# Altium project CMRat_GEN2.8.PrjPcb (part 1 of 2)
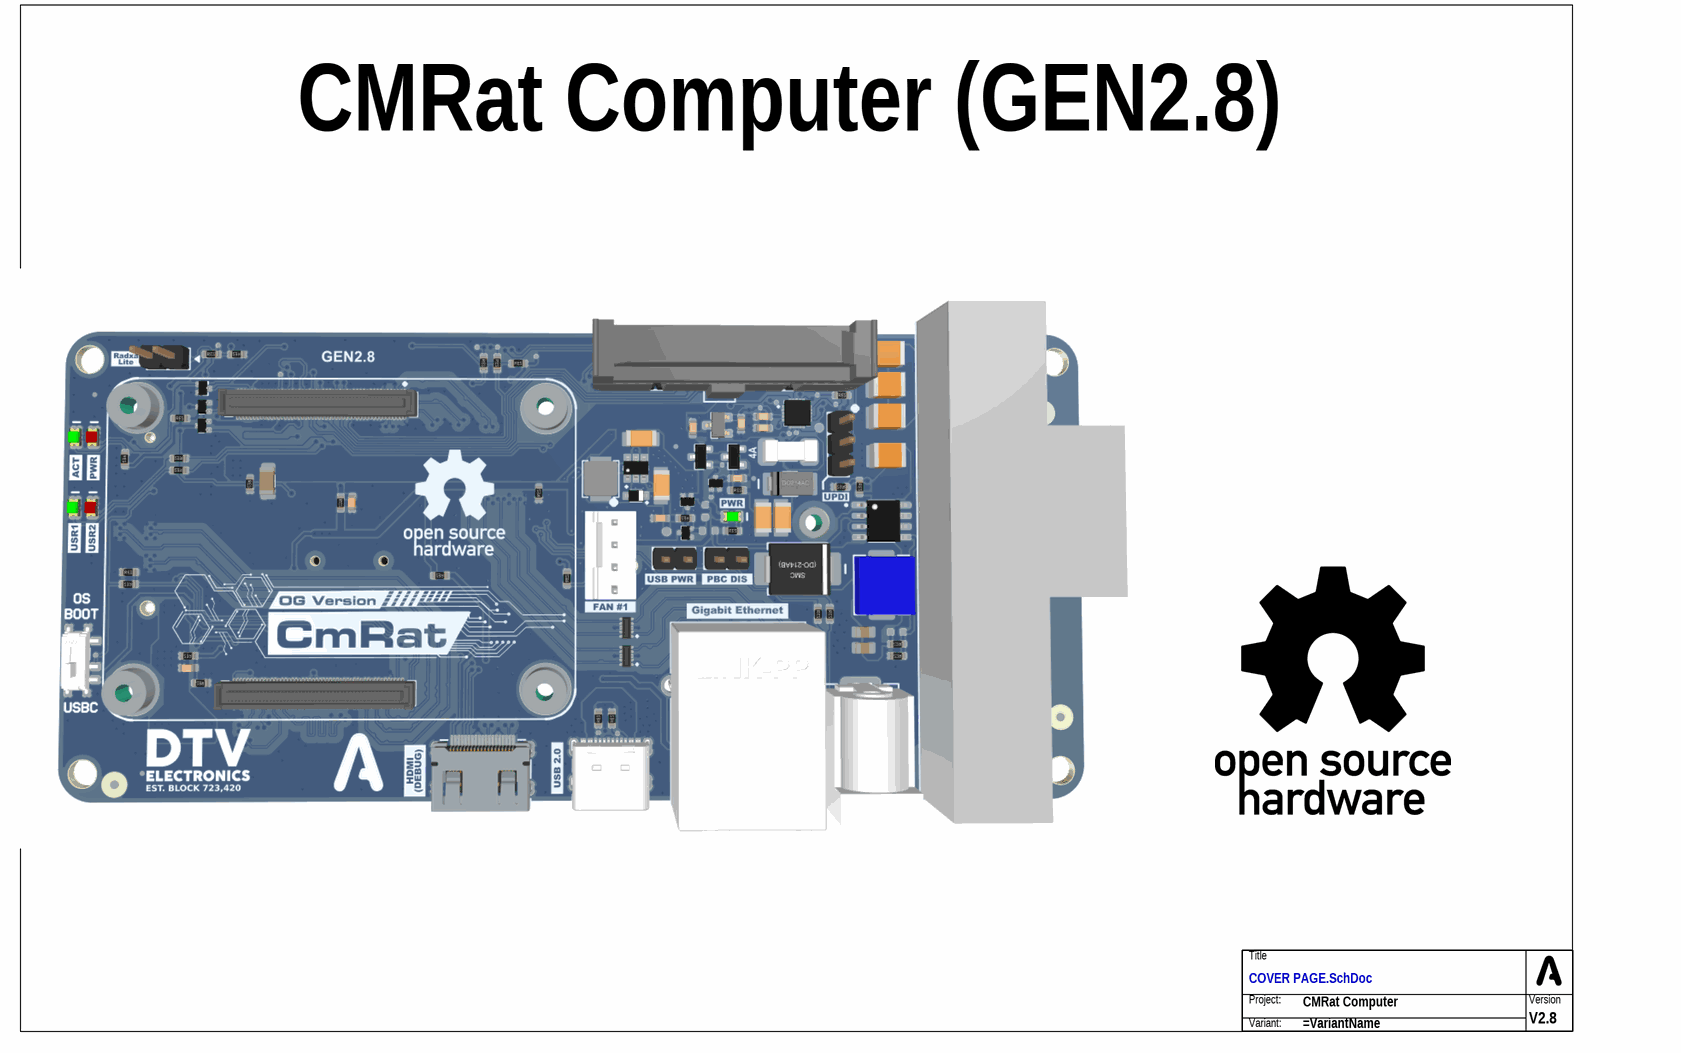
[diagram p0: COVER PAGE.SchDoc]
SchPcbVersion: V2.8; PCBProjectName: CMRat Computer (GEN2.8); PCBMarking: GEN2.8; OutputFileNamePrefix: CMRat_GEN2.8; OutputFileNamePrefix: CMRat_GEN2.8; GlobalProjectName: CMRat Computer
11 sheets, 217 parts. Net scope: global (net labels, ports and power ports of the same name join across sheets).
Board file: CMRat_GEN2.8.PcbDoc
Sheets:
  COVER PAGE.SchDoc
  TOP.SchDoc
    BLK1 = CM_MODULE.SchDoc
    BLK4 = PCIe.SchDoc
    BLK5 = USB_C.SchDoc
    BLK4 = Ethernet.SchDoc
    BLK4 = SD.SchDoc
    BLK4 = PWR.SchDoc
    BLK4 = MISC.SchDoc
    BLK4 = HDMI.SchDoc
    BLK4 = PBC.SchDoc

## Sheet COVER PAGE.SchDoc: =GlobalProjectName
size A4; SheetNumber: 1; SheetTotal: 11; Designators: -; PageSize: A3

### Parts
TB1  (no value)  (no BOM)

### Notes on the sheet
- (in symbol SCH_TITLE_BLOCK_SIMPLE_NODATE) Title; Project:; Version; Variant:

### Library data of the parts
TB1 = SCH_TITLE_BLOCK_SIMPLE_NODATE

## Sheet TOP.SchDoc: Top schematic
size A4; SheetNumber: 3; SheetTotal: 11
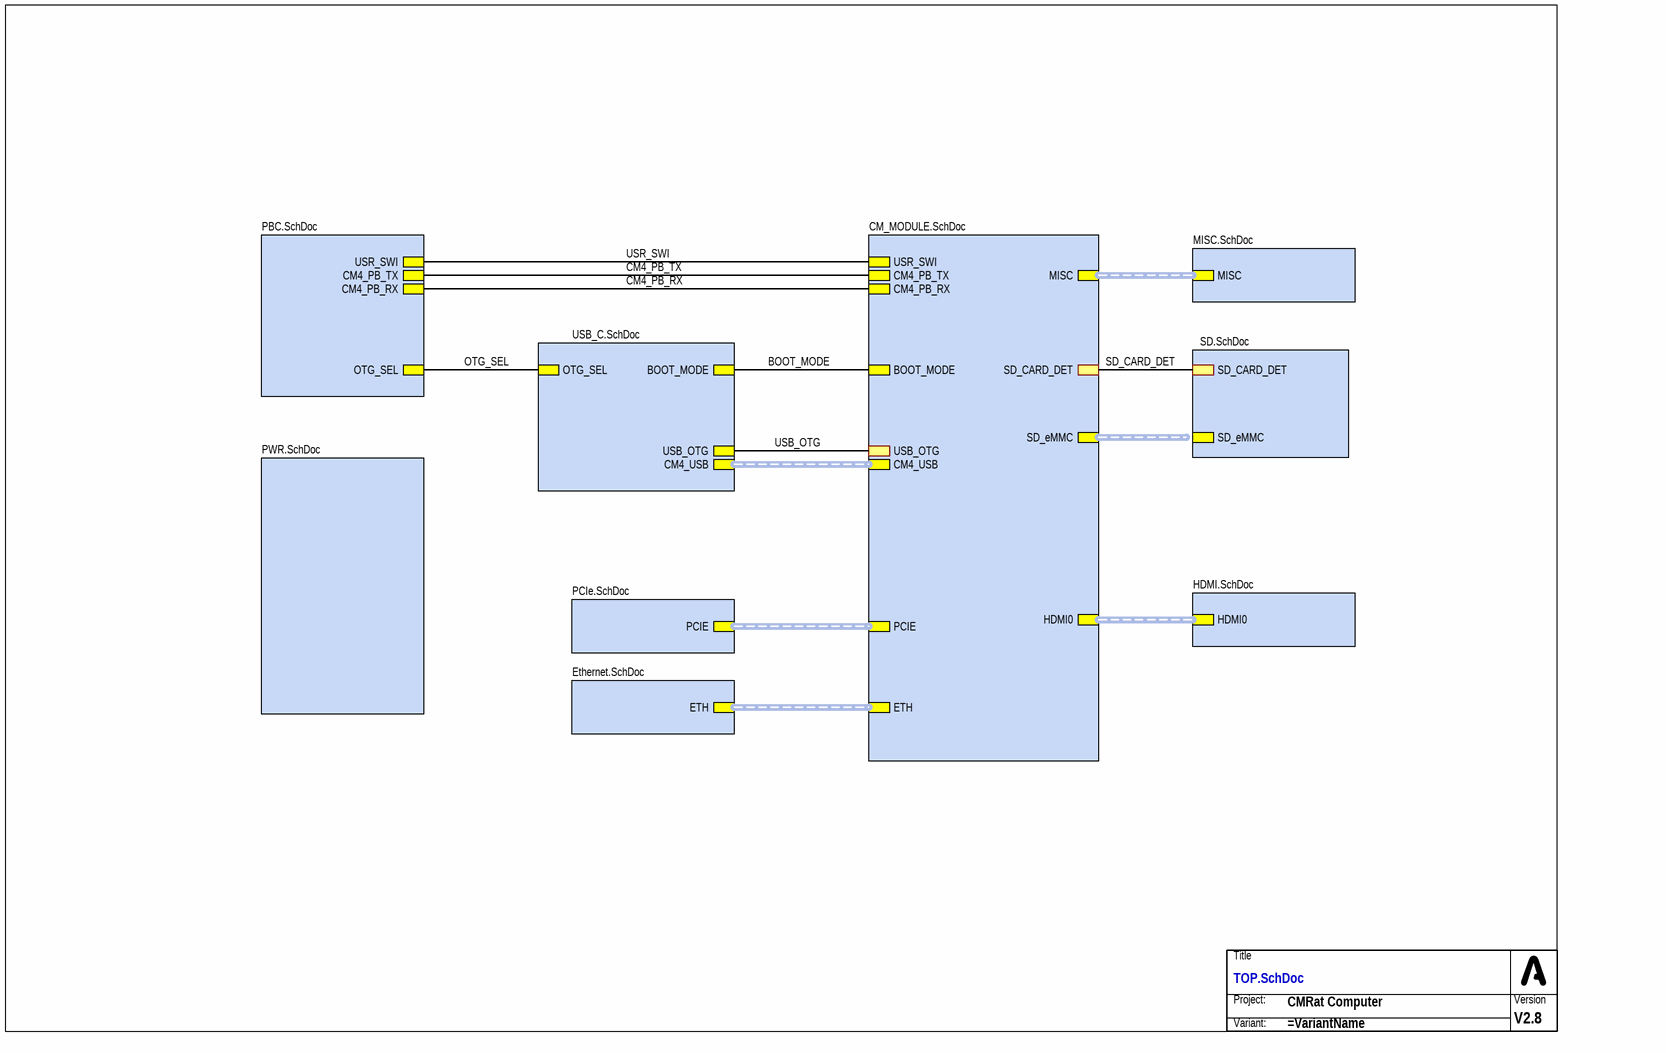
[diagram p1: TOP.SchDoc]

### Parts
(Parts that share a designator on the sheet are numbered #1, #2 ... from top to bottom, then left to right.)
TB?#1  (no value)  (no BOM)

### Sub-sheets
BLK1 = CM_MODULE.SchDoc: BOOT_MODE, MISC (harness MISC), USR_SWI, CM4_PB_TX, CM4_PB_RX, SD_CARD_DET, HDMI0 (harness HDMI), SD_eMMC (harness SD_eMMC), USB_OTG, CM4_USB (harness CM4_USB), PCIE (harness PCIE), ETH (harness ETH)
BLK4 = PCIe.SchDoc: PCIE (harness PCIE)
BLK4 = Ethernet.SchDoc: ETH (harness ETH)
BLK4 = SD.SchDoc: SD_eMMC (harness SD_eMMC), SD_CARD_DET
BLK4 = PWR.SchDoc: no entries
BLK4 = MISC.SchDoc: MISC (harness MISC)
BLK4 = HDMI.SchDoc: HDMI0 (harness HDMI)
BLK4 = PBC.SchDoc: OTG_SEL, USR_SWI, CM4_PB_TX, CM4_PB_RX
BLK5 = USB_C.SchDoc: CM4_USB (harness CM4_USB), BOOT_MODE, USB_OTG, OTG_SEL

### Nets
BOOT_MODE: sheet BLK1/BOOT_MODE, sheet BLK5/BOOT_MODE
CM4_PB_RX: sheet BLK1/CM4_PB_RX, sheet BLK4/CM4_PB_RX
CM4_PB_TX: sheet BLK1/CM4_PB_TX, sheet BLK4/CM4_PB_TX
OTG_SEL: sheet BLK5/OTG_SEL, sheet BLK4/OTG_SEL
SD_CARD_DET: sheet BLK1/SD_CARD_DET, sheet BLK4/SD_CARD_DET
USB_OTG: sheet BLK1/USB_OTG, sheet BLK5/USB_OTG  [project net CM_USB_OTG]
USR_SWI: sheet BLK1/USR_SWI, sheet BLK4/USR_SWI

### Buses and harness runs
harness sheet BLK1/CM4_USB = sheet BLK5/CM4_USB
harness sheet BLK1/ETH = sheet BLK4/ETH
harness sheet BLK1/HDMI0 = sheet BLK4/HDMI0
harness sheet BLK1/MISC = sheet BLK4/MISC
harness sheet BLK1/PCIE = sheet BLK4/PCIE

### Notes on the sheet
- (in symbol SCH_TITLE_BLOCK_SIMPLE_NODATE) Title; Project:; Version; Variant:

### Library data of the parts
TB?#1 = SCH_TITLE_BLOCK_SIMPLE_NODATE

## Sheet CM_MODULE.SchDoc: Compute Module 4 (Part #2)
size A3
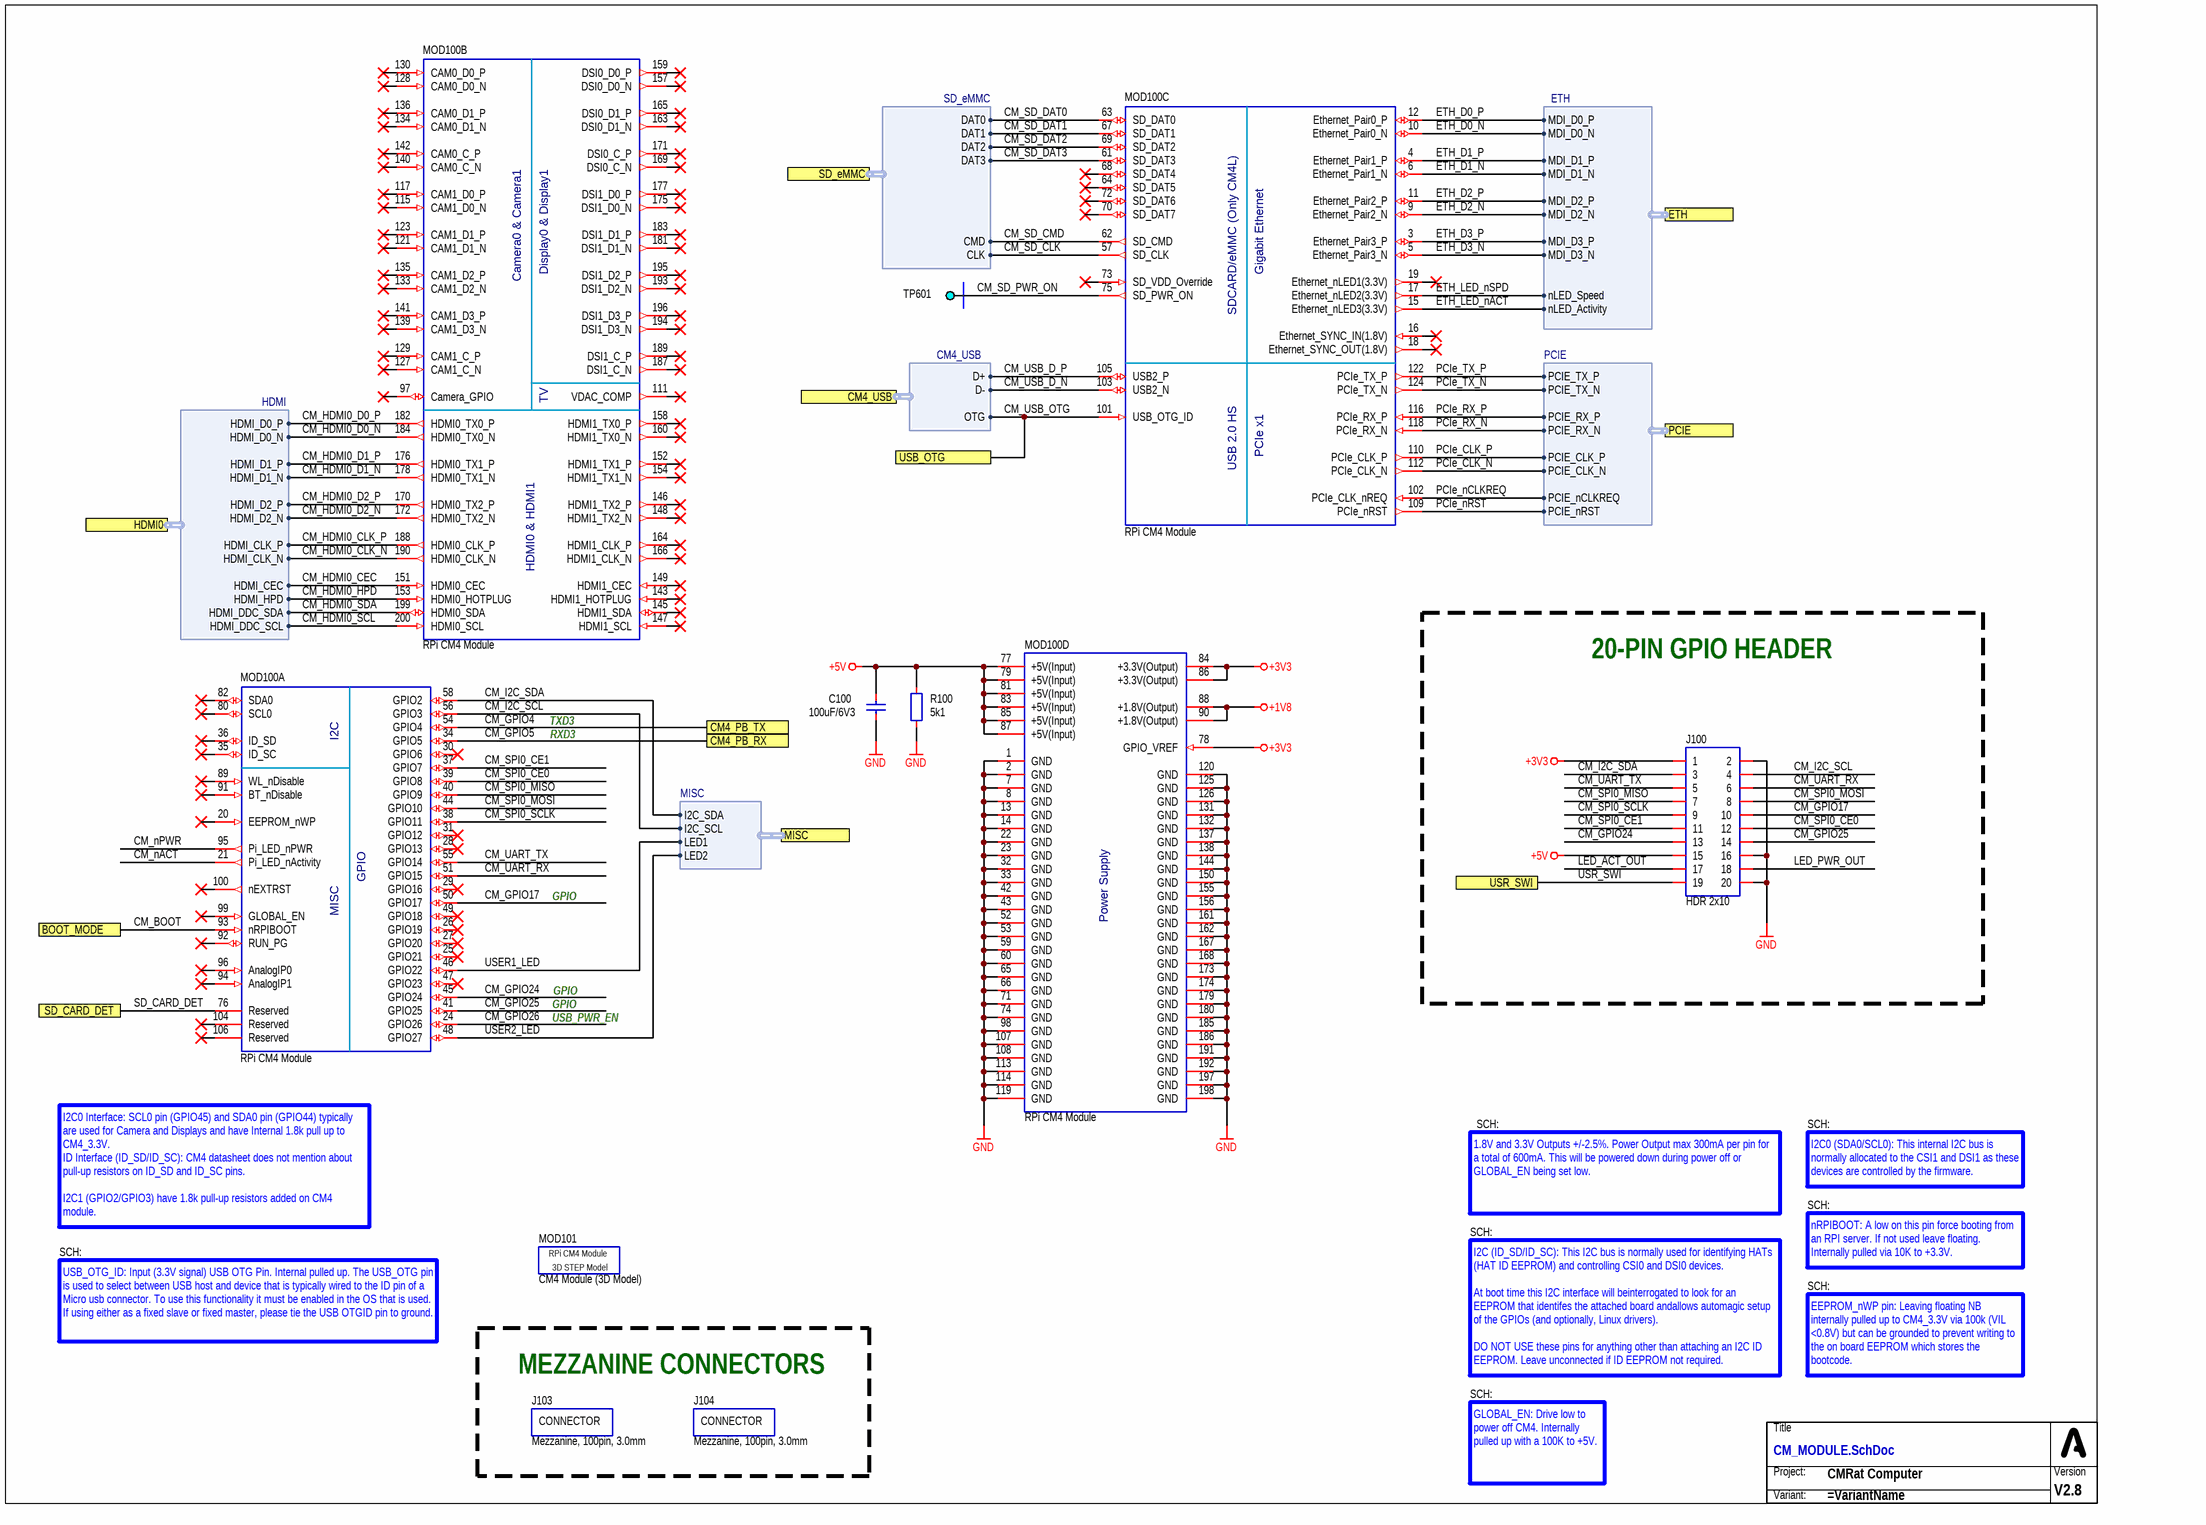
[diagram p2: CM_MODULE.SchDoc]

### Parts
C100  100uF/6V3  [CAP_1206_R]
J100  HDR 2x10  [CON_HDR_P254_2X10_STR]
J103  Mezzanine, 100pin, 3.0mm  [PCB_BLANK_COMP_SMD]
J104  Mezzanine, 100pin, 3.0mm  [PCB_BLANK_COMP_SMD]
MOD100  RPi CM4 Module  [MOD_RPI_CM4_SOCKET_P40_C300]  (parts A,B,C,D of 4)
MOD101  CM4 Module (3D Model)  [MOD_RPI_CM4_3D_C300_A1]  (no BOM)
R100  5k1  [RES_0603_R]
TB100  (no value)  (no BOM)
TP601  DEBUG  [PCB_TP_DBG_50]  (value not drawn)  (no BOM)

### Ports
BOOT_MODE, CM4_PB_RX, CM4_PB_TX, CM4_USB (harness CM4_USB), ETH (harness ETH), HDMI0 (harness HDMI), MISC (harness MISC), PCIE (harness PCIE), SD_CARD_DET, SD_eMMC (harness SD_eMMC), USB_OTG, USR_SWI

### Harnesses
SD_eMMC: DAT0, DAT1, DAT2, DAT3, CMD, CLK
CM4_USB: D+, D-, OTG
ETH: MDI_D0_P, MDI_D0_N, MDI_D1_P, MDI_D1_N, MDI_D2_P, MDI_D2_N, MDI_D3_P, MDI_D3_N, nLED_Speed, nLED_Activity
PCIE: PCIE_TX_P, PCIE_TX_N, PCIE_RX_P, PCIE_RX_N, PCIE_CLK_P, PCIE_CLK_N, PCIE_nCLKREQ, PCIE_nRST
HDMI: HDMI_D0_P, HDMI_D0_N, HDMI_D1_P, HDMI_D1_N, HDMI_CEC, HDMI_DDC_SDA, HDMI_D2_P, HDMI_D2_N, HDMI_CLK_P, HDMI_CLK_N, HDMI_DDC_SCL, HDMI_HPD
MISC: I2C_SDA, I2C_SCL, LED1, LED2

### Nets
+1V8: MOD100.88(+1.8V(Output)) MOD100.90(+1.8V(Output))
+3V3: J100.1 MOD100.78(GPIO_VREF) MOD100.84(+3.3V(Output)) MOD100.86(+3.3V(Output))
+5V: C100.2 J100.15 MOD100.77(+5V(Input)) MOD100.79(+5V(Input)) MOD100.81(+5V(Input)) MOD100.83(+5V(Input)) MOD100.85(+5V(Input)) MOD100.87(+5V(Input)) R100.1
GND: C100.1 J100.2 J100.16 J100.20 MOD100.1(GND) MOD100.2(GND) MOD100.7(GND) MOD100.8(GND) MOD100.13(GND) MOD100.14(GND) MOD100.22(GND) MOD100.23(GND) MOD100.32(GND) MOD100.33(GND) MOD100.42(GND) MOD100.43(GND) MOD100.52(GND) MOD100.53(GND) MOD100.59(GND) MOD100.60(GND) MOD100.65(GND) MOD100.66(GND) MOD100.71(GND) MOD100.74(GND) MOD100.98(GND) MOD100.107(GND) MOD100.108(GND) MOD100.113(GND) MOD100.114(GND) MOD100.119(GND) MOD100.120(GND) MOD100.125(GND) MOD100.126(GND) MOD100.131(GND) MOD100.132(GND) MOD100.137(GND) MOD100.138(GND) MOD100.144(GND) MOD100.150(GND) MOD100.155(GND) MOD100.156(GND) MOD100.161(GND) MOD100.162(GND) MOD100.167(GND) MOD100.168(GND) MOD100.173(GND) MOD100.174(GND) MOD100.179(GND) MOD100.180(GND) MOD100.185(GND) MOD100.186(GND) MOD100.191(GND) MOD100.192(GND) MOD100.197(GND) MOD100.198(GND) R100.2
CM_BOOT: MOD100.93(nRPIBOOT) ; port BOOT_MODE  [project net BOOT_MODE]
CM_GPIO4: MOD100.54(GPIO4) ; port CM4_PB_TX  [project net CM4_PB_TX]
CM_GPIO5: MOD100.34(GPIO5) ; port CM4_PB_RX  [project net CM4_PB_RX]
CM_GPIO17: J100.10 MOD100.50(GPIO17)
CM_GPIO24: J100.13 MOD100.45(GPIO24)
CM_GPIO25: J100.14 MOD100.41(GPIO25)
CM_GPIO26: MOD100.24(GPIO26)
CM_HDMI0_CEC: MOD100.151(HDMI0_CEC) ; port HDMI0.HDMI_CEC
CM_HDMI0_CLK_N: MOD100.190(HDMI0_CLK_N) ; port HDMI0.HDMI_CLK_N
CM_HDMI0_CLK_P: MOD100.188(HDMI0_CLK_P) ; port HDMI0.HDMI_CLK_P
CM_HDMI0_D0_N: MOD100.184(HDMI0_TX0_N) ; port HDMI0.HDMI_D0_N
CM_HDMI0_D0_P: MOD100.182(HDMI0_TX0_P) ; port HDMI0.HDMI_D0_P
CM_HDMI0_D1_N: MOD100.178(HDMI0_TX1_N) ; port HDMI0.HDMI_D1_N
CM_HDMI0_D1_P: MOD100.176(HDMI0_TX1_P) ; port HDMI0.HDMI_D1_P
CM_HDMI0_D2_N: MOD100.172(HDMI0_TX2_N) ; port HDMI0.HDMI_D2_N
CM_HDMI0_D2_P: MOD100.170(HDMI0_TX2_P) ; port HDMI0.HDMI_D2_P
CM_HDMI0_HPD: MOD100.153(HDMI0_HOTPLUG) ; port HDMI0.HDMI_HPD
CM_HDMI0_SCL: MOD100.200(HDMI0_SCL) ; port HDMI0.HDMI_DDC_SCL
CM_HDMI0_SDA: MOD100.199(HDMI0_SDA) ; port HDMI0.HDMI_DDC_SDA
CM_I2C_SCL: J100.4 MOD100.56(GPIO3) ; port MISC.I2C_SCL
CM_I2C_SDA: J100.3 MOD100.58(GPIO2) ; port MISC.I2C_SDA
CM_nACT: MOD100.21(Pi_LED_nActivity)
CM_nPWR: MOD100.95(Pi_LED_nPWR)
CM_SD_CLK: MOD100.57(SD_CLK) ; port SD_eMMC.CLK
CM_SD_CMD: MOD100.62(SD_CMD) ; port SD_eMMC.CMD
CM_SD_DAT0: MOD100.63(SD_DAT0) ; port SD_eMMC.DAT0
CM_SD_DAT1: MOD100.67(SD_DAT1) ; port SD_eMMC.DAT1
CM_SD_DAT2: MOD100.69(SD_DAT2) ; port SD_eMMC.DAT2
CM_SD_DAT3: MOD100.61(SD_DAT3) ; port SD_eMMC.DAT3
CM_SD_PWR_ON: MOD100.75(SD_PWR_ON) TP601.1
CM_SPI0_CE0: J100.12 MOD100.39(GPIO8)
CM_SPI0_CE1: J100.11 MOD100.37(GPIO7)
CM_SPI0_MISO: J100.7 MOD100.40(GPIO9)
CM_SPI0_MOSI: J100.8 MOD100.44(GPIO10)
CM_SPI0_SCLK: J100.9 MOD100.38(GPIO11)
CM_UART_RX: J100.6 MOD100.51(GPIO15)
CM_UART_TX: J100.5 MOD100.55(GPIO14)
CM_USB_D_N: MOD100.103(USB2_N) ; port CM4_USB.D-
CM_USB_D_P: MOD100.105(USB2_P) ; port CM4_USB.D+
CM_USB_OTG: MOD100.101(USB_OTG_ID) ; port USB_OTG, port CM4_USB.OTG
ETH_D0_N: MOD100.10(Ethernet_Pair0_N) ; port ETH.MDI_D0_N
ETH_D0_P: MOD100.12(Ethernet_Pair0_P) ; port ETH.MDI_D0_P
ETH_D1_N: MOD100.6(Ethernet_Pair1_N) ; port ETH.MDI_D1_N
ETH_D1_P: MOD100.4(Ethernet_Pair1_P) ; port ETH.MDI_D1_P
ETH_D2_N: MOD100.9(Ethernet_Pair2_N) ; port ETH.MDI_D2_N
ETH_D2_P: MOD100.11(Ethernet_Pair2_P) ; port ETH.MDI_D2_P
ETH_D3_N: MOD100.5(Ethernet_Pair3_N) ; port ETH.MDI_D3_N
ETH_D3_P: MOD100.3(Ethernet_Pair3_P) ; port ETH.MDI_D3_P
ETH_LED_nACT: MOD100.15(Ethernet_nLED3(3.3V)) ; port ETH.nLED_Activity
ETH_LED_nSPD: MOD100.17(Ethernet_nLED2(3.3V)) ; port ETH.nLED_Speed
LED_ACT_OUT: J100.17
LED_PWR_OUT: J100.18
PCIe_CLK_N: MOD100.112(PCIe_CLK_N) ; port PCIE.PCIE_CLK_N
PCIe_CLK_P: MOD100.110(PCIe_CLK_P) ; port PCIE.PCIE_CLK_P
PCIe_nCLKREQ: MOD100.102(PCIe_CLK_nREQ) ; port PCIE.PCIE_nCLKREQ
PCIe_nRST: MOD100.109(PCIe_nRST) ; port PCIE.PCIE_nRST
PCIe_RX_N: MOD100.118(PCIe_RX_N) ; port PCIE.PCIE_RX_N
PCIe_RX_P: MOD100.116(PCIe_RX_P) ; port PCIE.PCIE_RX_P
PCIe_TX_N: MOD100.124(PCIe_TX_N) ; port PCIE.PCIE_TX_N
PCIe_TX_P: MOD100.122(PCIe_TX_P) ; port PCIE.PCIE_TX_P
SD_CARD_DET: MOD100.76(Reserved) ; port SD_CARD_DET
USER1_LED: MOD100.46(GPIO22) ; port MISC.LED1
USER2_LED: MOD100.48(GPIO27) ; port MISC.LED2
USR_SWI: J100.19 ; port USR_SWI

Not connected (* = marked no-connect by the designer): MOD100 16(Ethernet_SYNC_IN(1.8V))* 18(Ethernet_SYNC_OUT(1.8V))* 19(Ethernet_nLED1(3.3V))* 20(EEPROM_nWP)* 25(GPIO21)* 26(GPIO19)* 27(GPIO20)* 28(GPIO13)* 29(GPIO16)* 30(GPIO6)* 31(GPIO12)* 35(ID_SC)* 36(ID_SD)* 47(GPIO23)* 49(GPIO18)* 64(SD_DAT5)* 68(SD_DAT4)* 70(SD_DAT7)* 72(SD_DAT6)* 73(SD_VDD_Override)* 80(SCL0)* 82(SDA0)* 89(WL_nDisable)* 91(BT_nDisable)* 92(RUN_PG)* 94(AnalogIP1)* 96(AnalogIP0)* 97(Camera_GPIO)* 99(GLOBAL_EN)* 100(nEXTRST)* 104(Reserved)* 106(Reserved)* 111(VDAC_COMP)* 115(CAM1_D0_N)* 117(CAM1_D0_P)* 121(CAM1_D1_N)* 123(CAM1_D1_P)* 127(CAM1_C_N)* 128(CAM0_D0_N)* 129(CAM1_C_P)* 130(CAM0_D0_P)* 133(CAM1_D2_N)* 134(CAM0_D1_N)* 135(CAM1_D2_P)* 136(CAM0_D1_P)* 139(CAM1_D3_N)* 140(CAM0_C_N)* 141(CAM1_D3_P)* 142(CAM0_C_P)* 143(HDMI1_HOTPLUG)* 145(HDMI1_SDA)* 146(HDMI1_TX2_P)* 147(HDMI1_SCL)* 148(HDMI1_TX2_N)* 149(HDMI1_CEC)* 152(HDMI1_TX1_P)* 154(HDMI1_TX1_N)* 157(DSI0_D0_N)* 158(HDMI1_TX0_P)* 159(DSI0_D0_P)* 160(HDMI1_TX0_N)* 163(DSI0_D1_N)* 164(HDMI1_CLK_P)* 165(DSI0_D1_P)* 166(HDMI1_CLK_N)* 169(DSI0_C_N)* 171(DSI0_C_P)* 175(DSI1_D0_N)* 177(DSI1_D0_P)* 181(DSI1_D1_N)* 183(DSI1_D1_P)* 187(DSI1_C_N)* 189(DSI1_C_P)* 193(DSI1_D2_N)* 194(DSI1_D3_N)* 195(DSI1_D2_P)* 196(DSI1_D3_P)*

### Notes on the sheet
- TXD3
- 20-PIN GPIO HEADER
- RXD3
- GPIO
- USB_PWR_EN
- SCH:
- I2C0 (SDA0/SCL0): This internal I2C bus is normally allocated to the CSI1 and DSI1 as these devices are controlled by the firmware.
- I2C0 Interface: SCL0 pin (GPIO45) and SDA0 pin (GPIO44) typically are used for Camera and Displays and have Internal 1.8k pull up to CM4_3.3V.
  ID Interface (ID_SD/ID_SC): CM4 datasheet does not mention about pull-up resistors on ID_SD and ID_SC pins.
  I2C1 (GPIO2/GPIO3) have 1.8k pull-up resistors added on CM4 module.
- 1.8V and 3.3V Outputs +/-2.5%. Power Output max 300mA per pin for a total of 600mA. This will be powered down during power off or GLOBAL_EN being set low.
- nRPIBOOT: A low on this pin force booting from an RPI server. If not used leave floating. Internally pulled via 10K to +3.3V.
- USB_OTG_ID: Input (3.3V signal) USB OTG Pin. Internal pulled up. The USB_OTG pin is used to select between USB host and device that is typically wired to the ID pin of a Micro usb connector. To use this functionality it must be enabled in the OS that is used. If using either as a fixed slave or fixed master, please tie the USB OTGID pin to ground.
- MEZZANINE CONNECTORS
- (near TB100) I2C (ID_SD/ID_SC): This I2C bus is normally used for identifying HATs (HAT ID EEPROM) and controlling CSI0 and DSI0 devices.
  At boot time this I2C interface will beinterrogated to look for an EEPROM that identifes the attached board andallows automagic setup of the GPIOs (and optionally, Linux drivers).
  DO NOT USE these pins for anything other than attaching an I2C ID EEPROM. Leave unconnected if ID EEPROM not required.
- EEPROM_nWP pin: Leaving floating NB internally pulled up to CM4_3.3V via 100k (VIL <0.8V) but can be grounded to prevent writing to the on board EEPROM which stores the bootcode.
- GLOBAL_EN: Drive low to power off CM4. Internally pulled up with a 100K to +5V.
- (in symbol BOM_CON) CONNECTOR
- (in symbol MOD_CM4_3D_MODEL) RPi CM4 Module
- (in symbol MOD_RPI_CM4_VAR2, part A) I2C; GPIO; MISC
- (in symbol MOD_RPI_CM4_VAR2, part B) Display0 & Display1; Camera0 & Camera1; TV; HDMI0 & HDMI1
- (in symbol MOD_RPI_CM4_VAR2, part C) Gigabit Ethernet; SDCARD/eMMC (Only CM4L); PCIe x1; USB 2.0 HS
- (in symbol MOD_RPI_CM4_VAR2, part D) Power Supply
- (in symbol SCH_TITLE_BLOCK_SIMPLE_NODATE) Title; Project:; Version; Variant:

### Library data of the parts
C100 = CAP-0025: Capacitor; MLCC; 100uF 6V3; Manufacturer: Taiyo Yuden; MPN: JMK316ABJ107ML-T; Package (Case): 1206; Component Type: Capacitor; Component Subtype: MLCC; Value: 100uF/6V3; Mounting Type: SMD
J100 = CON_2X10_ROW: CONN THT / HEADER / PITCH 2,54mm / VERTICAL / (20 PIN) 2x10; MPN: B-2100S20P-B110; Manufacturer: Ckmtw(Shenzhen Cankemeng); Component Subtype: Pin Header; Component Type: Connector; Mounting Type: THT; Package (Case): THT; Value: HDR 2x10
J103 J104 = BOM_CON: Connector; DF40HC(3.0)-100DS-0.4V; Manufacturer: Hirose; Component Subtype: Microminiature; Package (Case): SMD; MPN: DF40HC(3.0)-100DS-0.4V; Value: Mezzanine, 100pin, 3.0mm; Component Type: Connector; Mounting Type: SMD
MOD100 = MOD_RPI_CM4_VAR2: PCB Module; RPi Compute Module 4;; Manufacturer: Raspberry Pi Foundation; Component Subtype: Raspberry Pi CM4; MPN: CM4 Module; Value: RPi CM4 Module; Component Type: PCB Module
MOD101 = MOD_CM4_3D_MODEL: PCB Module; RPi Compute Module 4; 3D model; Component Subtype: 3D STEP Model; Component Type: PCB Module; Value: CM4 Module (3D Model)
R100 = RES-0043: Resistor; Thick Film; 5k1; 1%; 100mW; 100PPM; 75V; Standard; SMD; 0603 (1608);; Manufacturer: UNI-ROYAL(Uniroyal Elec); MPN: 0603WAF5101T5E; Package (Case): 0603; Component Type: Resistor; Component Subtype: Thick Film; Value: 5k1; Mounting Type: SMD
TB100 = SCH_TITLE_BLOCK_SIMPLE_NODATE
TP601 = PCB_TP_DBG: PCB Marking; Test Point (Debug);; Value: DEBUG; Component Type: Testpoint

## Sheet PCIe.SchDoc: M.2 PCIe x1 Socket
size A4
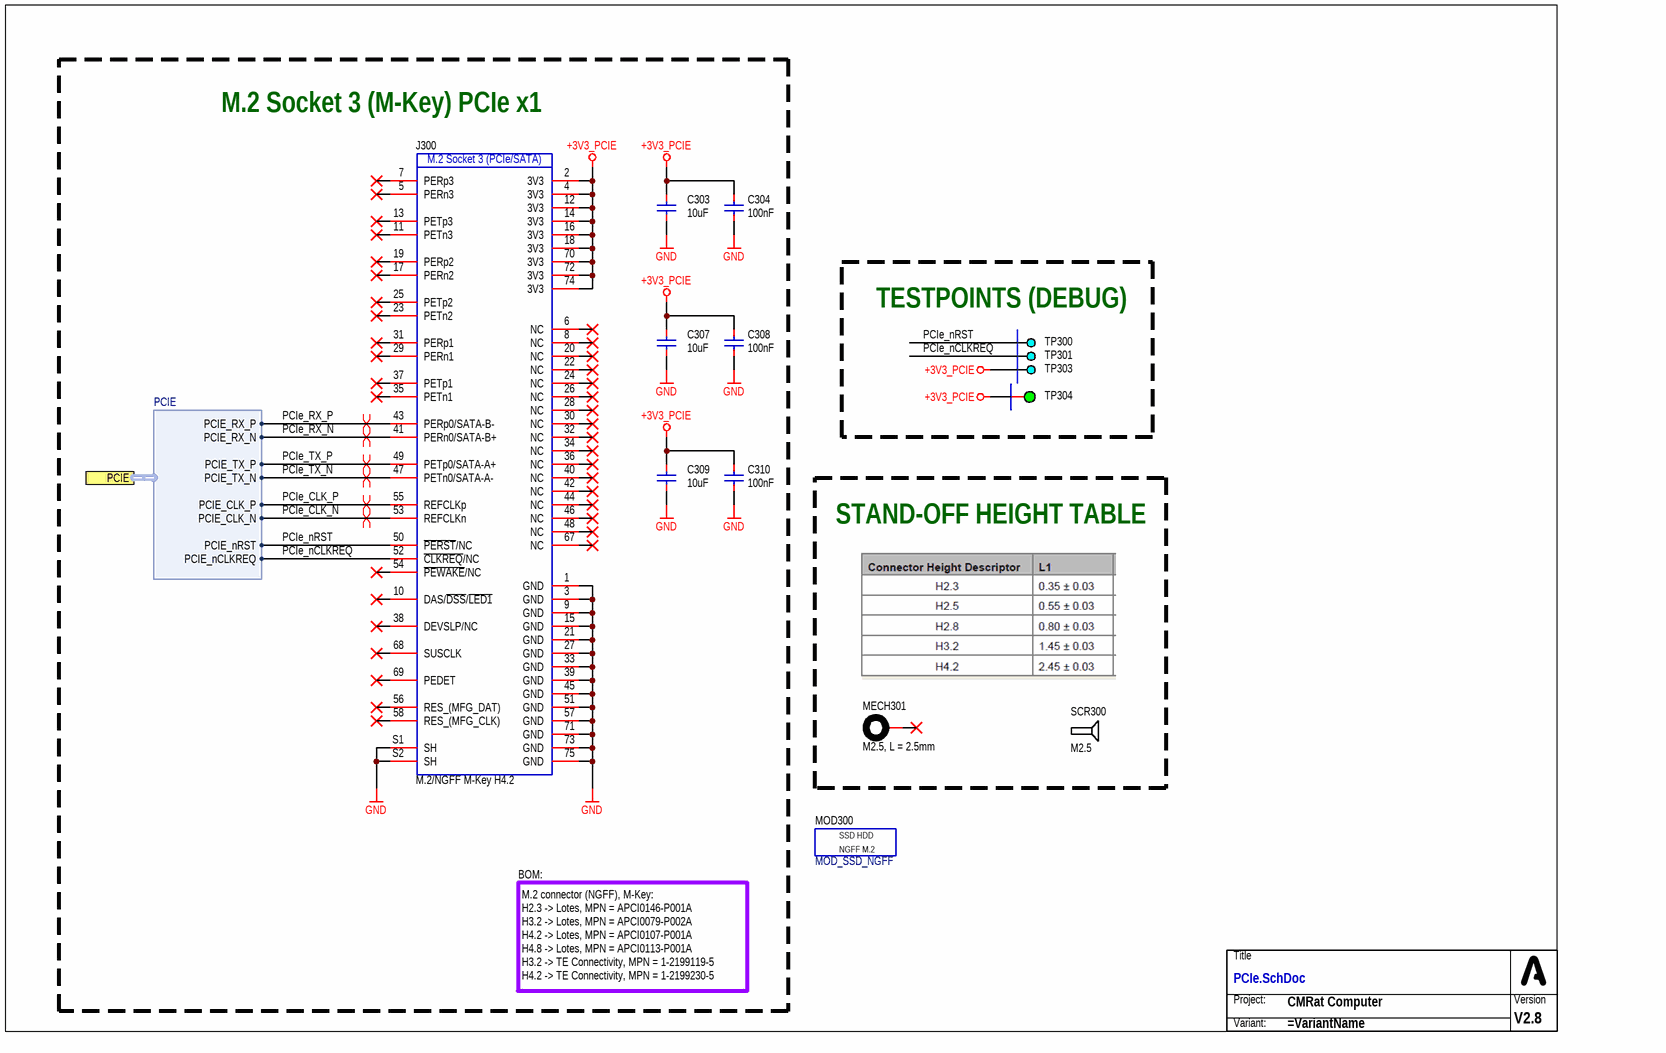
[diagram p3: PCIe.SchDoc]

### Parts
(Parts that share a designator on the sheet are numbered #1, #2 ... from top to bottom, then left to right.)
C303  10uF  [CAP_0603_R]
C304  100nF  [CAP_0603_R]
C307  10uF  [CAP_0603_R]
C308  100nF  [CAP_0603_R]
C309  10uF  [CAP_0603_R]
C310  100nF  [CAP_0603_R]
J300  M.2/NGFF M-Key H4.2  [CON_NGFF_KEY-M_P67_H420]
MECH301  M2.5, L = 2.5mm  [PCB_WRT_9774030151]
MOD300  MOD_SSD_NGFF  [MOD_SSD_NGFF_2280_B+M_SAM_EVO850_H300]  (no BOM)
SCR300  M2.5  (mechanical)
TB?#2  (no value)  (no BOM)
TP300  DEBUG  [PCB_TP_DBG_50]  (value not drawn)  (no BOM)
TP301  DEBUG  [PCB_TP_DBG_50]  (value not drawn)  (no BOM)
TP303  DEBUG  [PCB_TP_DBG_50]  (value not drawn)  (no BOM)
TP304  ICT  [PCB_TP_ICT_100]  (value not drawn)  (no BOM)

### Ports
PCIE (harness PCIE)

### Harnesses
PCIE: PCIE_TX_P, PCIE_TX_N, PCIE_RX_P, PCIE_RX_N, PCIE_CLK_P, PCIE_CLK_N, PCIE_nCLKREQ, PCIE_nRST

### Nets
+3V3_PCIE: C303.2 C304.2 C307.2 C308.2 C309.2 C310.2 J300.2(3V3) J300.4(3V3) J300.12(3V3) J300.14(3V3) J300.16(3V3) J300.18(3V3) J300.70(3V3) J300.72(3V3) J300.74(3V3) TP303.1 TP304.1
GND: C303.1 C304.1 C307.1 C308.1 C309.1 C310.1 J300.1(GND) J300.3(GND) J300.9(GND) J300.15(GND) J300.21(GND) J300.27(GND) J300.33(GND) J300.39(GND) J300.45(GND) J300.51(GND) J300.57(GND) J300.71(GND) J300.73(GND) J300.75(GND) J300.S1(SH) J300.S2(SH)
PCIe_CLK_N: J300.53(REFCLKn) ; port PCIE.PCIE_CLK_N
PCIe_CLK_P: J300.55(REFCLKp) ; port PCIE.PCIE_CLK_P
PCIe_nCLKREQ: J300.52(~{CLKREQ}/NC) TP301.1 ; port PCIE.PCIE_nCLKREQ
PCIe_nRST: J300.50(~{PERST}/NC) TP300.1 ; port PCIE.PCIE_nRST
PCIe_RX_N: J300.41(PERn0/SATA-B+) ; port PCIE.PCIE_RX_N
PCIe_RX_P: J300.43(PERp0/SATA-B-) ; port PCIE.PCIE_RX_P
PCIe_TX_N: J300.47(PETn0/SATA-A-) ; port PCIE.PCIE_TX_N
PCIe_TX_P: J300.49(PETp0/SATA-A+) ; port PCIE.PCIE_TX_P

Not connected (* = marked no-connect by the designer): J300 5(PERn3)* 6(NC)* 7(PERp3)* 8(NC)* 10(DAS/~{DSS}/~{LED1})* 11(PETn3)* 13(PETp3)* 17(PERn2)* 19(PERp2)* 20(NC)* 22(NC)* 23(PETn2)* 24(NC)* 25(PETp2)* 26(NC)* 28(NC)* 29(PERn1)* 30(NC)* 31(PERp1)* 32(NC)* 34(NC)* 35(PETn1)* 36(NC)* 37(PETp1)* 38(DEVSLP/NC)* 40(NC)* 42(NC)* 44(NC)* 46(NC)* 48(NC)* 54(~{PEWAKE}/NC)* 56(RES_(MFG_DAT))* 58(RES_(MFG_CLK))* 67(NC)* 68(SUSCLK)* 69(PEDET)*; MECH301 1*

### Layout directives
differential pair: PCIe_CLK_N, PCIe_CLK_P, PCIe_RX_N, PCIe_RX_P, PCIe_TX_N, PCIe_TX_P

### Notes on the sheet
- M.2 Socket 3 (M-Key) PCIe x1
- TESTPOINTS (DEBUG)
- STAND-OFF HEIGHT TABLE
- BOM:
- M.2 connector (NGFF), M-Key:
  H2.3 -> Lotes, MPN = APCI0146-P001A
  H3.2 -> Lotes, MPN = APCI0079-P002A
  H4.2 -> Lotes, MPN = APCI0107-P001A
  H4.8 -> Lotes, MPN = APCI0113-P001A
  H3.2 -> TE Connectivity, MPN = 1-2199119-5
  H4.2 -> TE Connectivity, MPN = 1-2199230-5
- (in symbol CON_NGFF_M-KEY_A2) M.2 Socket 3 (PCIe/SATA)
- (in symbol MOD_SSD_NGFF) SSD HDD; NGFF M.2
- (in symbol SCH_TITLE_BLOCK_SIMPLE_NODATE) Title; Project:; Version; Variant:

### Library data of the parts
C303 C307 C309 = CAP-0023: CAP SMD 10u/10V ±10% 10V X5R (0603); Manufacturer: Samsung Electro-Mechanics; MPN: CL10A106KP8NNNC; Component Subtype: MLCC; Package (Case): 0603; Component Type: Capacitor; Value: 10uF; Mounting Type: SMD
C304 C308 C310 = CAP-0008: Capacitor; MLCC; 100nF; 10V X5R; Manufacturer: YAGEO; MPN: CC0603KRX7R9BB104; Package (Case): 0603; Component Type: Capacitor; Component Subtype: MLCC; Value: 100nF; Mounting Type: SMD
J300 = CON_NGFF_M-KEY_A2: Connector; NGFF (M.2); M-Key;; Manufacturer: Lotes; MPN: APCI0107-P001A; Component Subtype: M.2 Socket (M-Key); Package (Case): SMD; Component Type: Connector; Mounting Type: SMD; Value: M.2/NGFF M-Key H4.2
MECH301 = PCB_MECH_WRT_WA-SMSI: PCB; Mechanical; SMT Steel Spacer; M2.5;; Manufacturer: Wurth Elektronik; MPN: 977 402 515 1; Component Subtype: SMD Spacer; Package (Case): SMD; Value: M2.5, L = 2.5mm; Component Type: Spacer (Standoff); Mounting Type: SMD
MOD300 = MOD_SSD_NGFF: Module; SSD Disk; NGFF M.2;; Component Type: M.2 Module (NGFF)
SCR300 = PCB_MECH_SCR: Mechnical; Screw;; MPN: M2.5 screw; Value: M2.5
TB?#2 = SCH_TITLE_BLOCK_SIMPLE_NODATE
TP300 TP301 TP303 = PCB_TP_DBG: PCB Marking; Test Point (Debug);; Value: DEBUG; Component Type: Testpoint
TP304 = PCB_TP_ICT: Test Point (ICT); Component Type: Testpoint (for ICT); Mounting Type: Non component; Value: ICT

## Sheet USB_C.SchDoc: USB-C interface and USB switch
size A4; SheetNumber: 6; SheetTotal: 15; PageSize: A4; Designators: 200-249
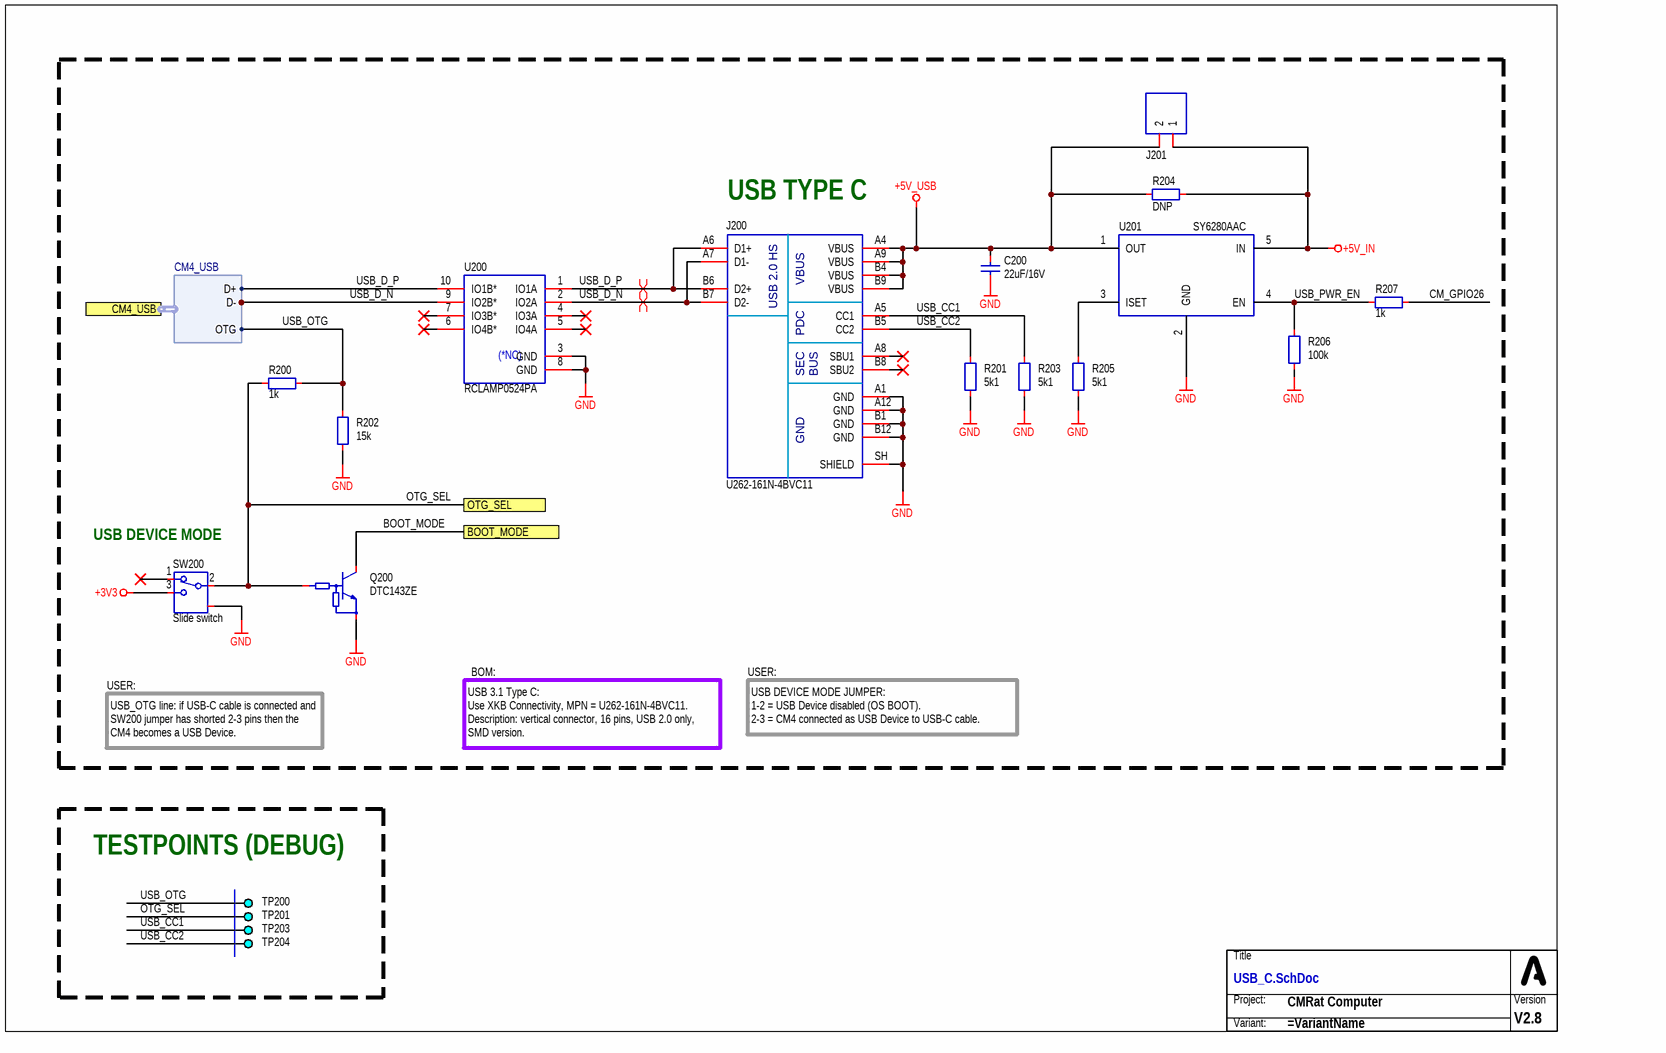
[diagram p4: USB_C.SchDoc]

### Parts
(Parts that share a designator on the sheet are numbered #1, #2 ... from top to bottom, then left to right.)
C200  22uF/16V  [CAP_0805_R]
J200  U262-161N-4BVC11  [CON_XKB_U262-161N-4BVC11]
J201  HDR 1x2  [CON_HDR_P254_1X02_STR]  (value not drawn)
Q200  DTC143ZE  [PKG_SOT523_SC75_SOT416_P100_R]
R200  1k  [RES_0603_R]
R201  5k1  [RES_0603_R]
R202  15k  [RES_0603_R]
R203  5k1  [RES_0603_R]
R204  DNP  [RES_1206_R]
R205  5k1  [RES_0603_R]
R206  100k  [RES_0603_R]
R207  1k  [RES_0603_R]
SW200  Slide switch  [SWI_XKB_SS-3292S-L1]
TB?#3  (no value)  (no BOM)
TP200  DEBUG  [PCB_TP_DBG_50]  (value not drawn)  (no BOM)
TP201  DEBUG  [PCB_TP_DBG_50]  (value not drawn)  (no BOM)
TP203  DEBUG  [PCB_TP_DBG_50]  (value not drawn)  (no BOM)
TP204  DEBUG  [PCB_TP_DBG_50]  (value not drawn)  (no BOM)
U200  RCLAMP0524PA  [ICC_SLP2510P8_250X100X60_P50_R]
U201  SY6280AAC  [PKG_SOT23-5_R]

### Ports
BOOT_MODE, CM4_USB (harness CM4_USB), OTG_SEL

### Harnesses
CM4_USB: D+, D-, OTG

### Nets
+3V3: SW200.3
+5V_IN: J201.1 R204.2 U201.5(IN)
+5V_USB: C200.2 J200.A4(VBUS) J200.A9(VBUS) J200.B4(VBUS) J200.B9(VBUS) J201.2 R204.1 U201.1(OUT)
GND: C200.1 J200.A1(GND) J200.A12(GND) J200.B1(GND) J200.B12(GND) J200.SH(SHIELD) Q200.2(E) R201.2 R202.1 R203.2 R205.2 R206.1 SW200.SH U200.3(GND) U200.8(GND) U201.2(GND)
BOOT_MODE: Q200.3(C) ; port BOOT_MODE
CM_GPIO26: R207.1
OTG_SEL: Q200.1(B) R200.2 SW200.2 TP201.1 ; port OTG_SEL
USB_CC1: J200.A5(CC1) R203.1 TP203.1
USB_CC2: J200.B5(CC2) R201.1 TP204.1
USB_D_N: J200.A7(D1-) J200.B7(D2-) U200.2(IO2A) U200.9(IO2B*) ; port CM4_USB.D-  [project net CM_USB_D_N]
USB_D_P: J200.A6(D1+) J200.B6(D2+) U200.1(IO1A) U200.10(IO1B*) ; port CM4_USB.D+  [project net CM_USB_D_P]
USB_OTG: R200.1 R202.2 TP200.1 ; port CM4_USB.OTG  [project net CM_USB_OTG]
USB_PWR_EN: R206.2 R207.2 U201.4(EN)
NetR205_1: R205.1 U201.3(ISET)

Not connected (* = marked no-connect by the designer): J200 A8(SBU1)* B8(SBU2)*; SW200 1*; U200 4(IO3A)* 5(IO4A)* 6(IO4B*)* 7(IO3B*)*

### Layout directives
differential pair: CM_USB_D_N, CM_USB_D_P

### Notes on the sheet
- (near J200) USB TYPE C
- (near SW200) USB DEVICE MODE
- USER:
- BOM:
- USB_OTG line: if USB-C cable is connected and SW200 jumper has shorted 2-3 pins then the CM4 becomes a USB Device.
- USB 3.1 Type C:
  Use XKB Connectivity, MPN = U262-161N-4BVC11.
  Description: vertical connector, 16 pins, USB 2.0 only, SMD version.
- USB DEVICE MODE JUMPER:
  1-2 = USB Device disabled (OS BOOT).
  2-3 = CM4 connected as USB Device to USB-C cable.
- TESTPOINTS (DEBUG)
- (in symbol CON_USB_TYPE_C_16P) USB 2.0 HS; PDC; SEC; BUS
- (in symbol ICC-0005) (*NC)
- (in symbol SCH_TITLE_BLOCK_SIMPLE_NODATE) Title; Project:; Version; Variant:

### Library data of the parts
C200 = CAP-0024: Capacitor; MLCC; 22u 16V; Manufacturer: Samsung Electro-Mechanics; MPN: CL21A226MOQNNNE; Package (Case): 0805; Component Type: Capacitor; Component Subtype: MLCC; Value: 22uF/16V; Mounting Type: SMD
J200 = CON_USB_TYPE_C_16P: Connector; USB 3.1 Type C; Receptacle; 24-pin; USB 2.0 Only;; Manufacturer: XKB Connectivity; Component Subtype: USB-C; Package (Case): SMD; Value: U262-161N-4BVC11; MPN: U262-161N-4BVC11; Component Type: Connector; Mounting Type: SMD
J201 = CON-0020: CONN THT / HEADER / PITCH 2,54mm / VERTICAL / (2 PIN); Manufacturer: Ckmtw(Shenzhen Cankemeng); MPN: B-2100S02P-A110; Component Subtype: Pin Header; Component Type: Connector; Value: HDR 1x2; Mounting Type: THT; Package (Case): THT
Q200 = TRA_BJT_NPN_DIG_BEC: Transistor; BJT; NPN; Digital;; Manufacturer: On Semiconductor; Component Subtype: NPN Transistor; Package (Case): SOT-523; Value: DTC143ZE; MPN: DTC143ZE; Component Type: Transistor; Mounting Type: SMD
R200 R207 = RES-0027: Resistor; Thick Film; 1k; 1%; 100mW; 100PPM; 75V; Standard; SMD; 0603 (1608);; Manufacturer: UNI-ROYAL(Uniroyal Elec); MPN: 0603WAF1001T5E; Package (Case): 0603; Component Type: Resistor; Component Subtype: Thick Film; Value: 1k; Mounting Type: SMD
R201 R203 R205 = RES-0043: as R100 on sheet CM_MODULE; Component Type: Resistor; Component Subtype: Thick Film; Value: 5k1; Mounting Type: SMD
R202 = RES-0043: Resistor; Thick Film; 15k; 1%; 100mW; 100PPM; 75V; Standard; SMD; 0603 (1608);; Manufacturer: UNI-ROYAL(Uniroyal Elec); MPN: 0603WAF1502T5E; Package (Case): 0603; Component Type: Resistor; Component Subtype: Thick Film; Value: 15k; Mounting Type: SMD
R204 = RES-0060: Component Subtype: Thick Film; Package (Case): 1206; Component Type: Resistor; Value: DNP; Mounting Type: SMD
R206 = RES-0029: Resistor; Thick Film; 100k; 1%; 100mW; 100PPM; 75V; Standard; SMD; 0603 (1608);; Manufacturer: UNI-ROYAL(Uniroyal Elec); MPN: 0603WAF1003T5E; Package (Case): 0603; Component Type: Resistor; Component Subtype: Thick Film; Value: 100k; Mounting Type: SMD
SW200 = SWI_SPDT_3P_SH1: Switch; SPDT;; Manufacturer: XKB Connectivity; MPN: SS-3292S-L1; Package (Case): SMD; Component Subtype: Slide; Component Type: Switch; Mounting Type: SMD; Value: Slide switch
TB?#3 = SCH_TITLE_BLOCK_SIMPLE_NODATE
TP200 TP201 TP203 TP204 = PCB_TP_DBG: PCB Marking; Test Point (Debug);; Value: DEBUG; Component Type: Testpoint
U200 = ICC-0005: IC; TVS Arrays; ESD Protection; 4-Channel; 17kV Air; 12kV Contact; 0.3pF Capitance; TBD; SMD; TBD;; Manufacturer: Semtech Corporation; MPN: RCLAMP0524PATCT; Package (Case): DFN-10(1x2.5); Component Type: IC; Component Subtype: TVS Arrays; Value: RCLAMP0524PA; Mounting Type: SMD
U201 = ITEM_U10052: IC SMD / LOAD SWITCH / 2.4V - 5.5V (SOT-23-5); Manufacturer: Silergy Corp; Package (Case): SOT-23-5; Mounting Type: SMD; MPN: SY6280AAC; Value: SY6280AAC

## Sheet Ethernet.SchDoc: 100/1000M Ethernet interface
size A4
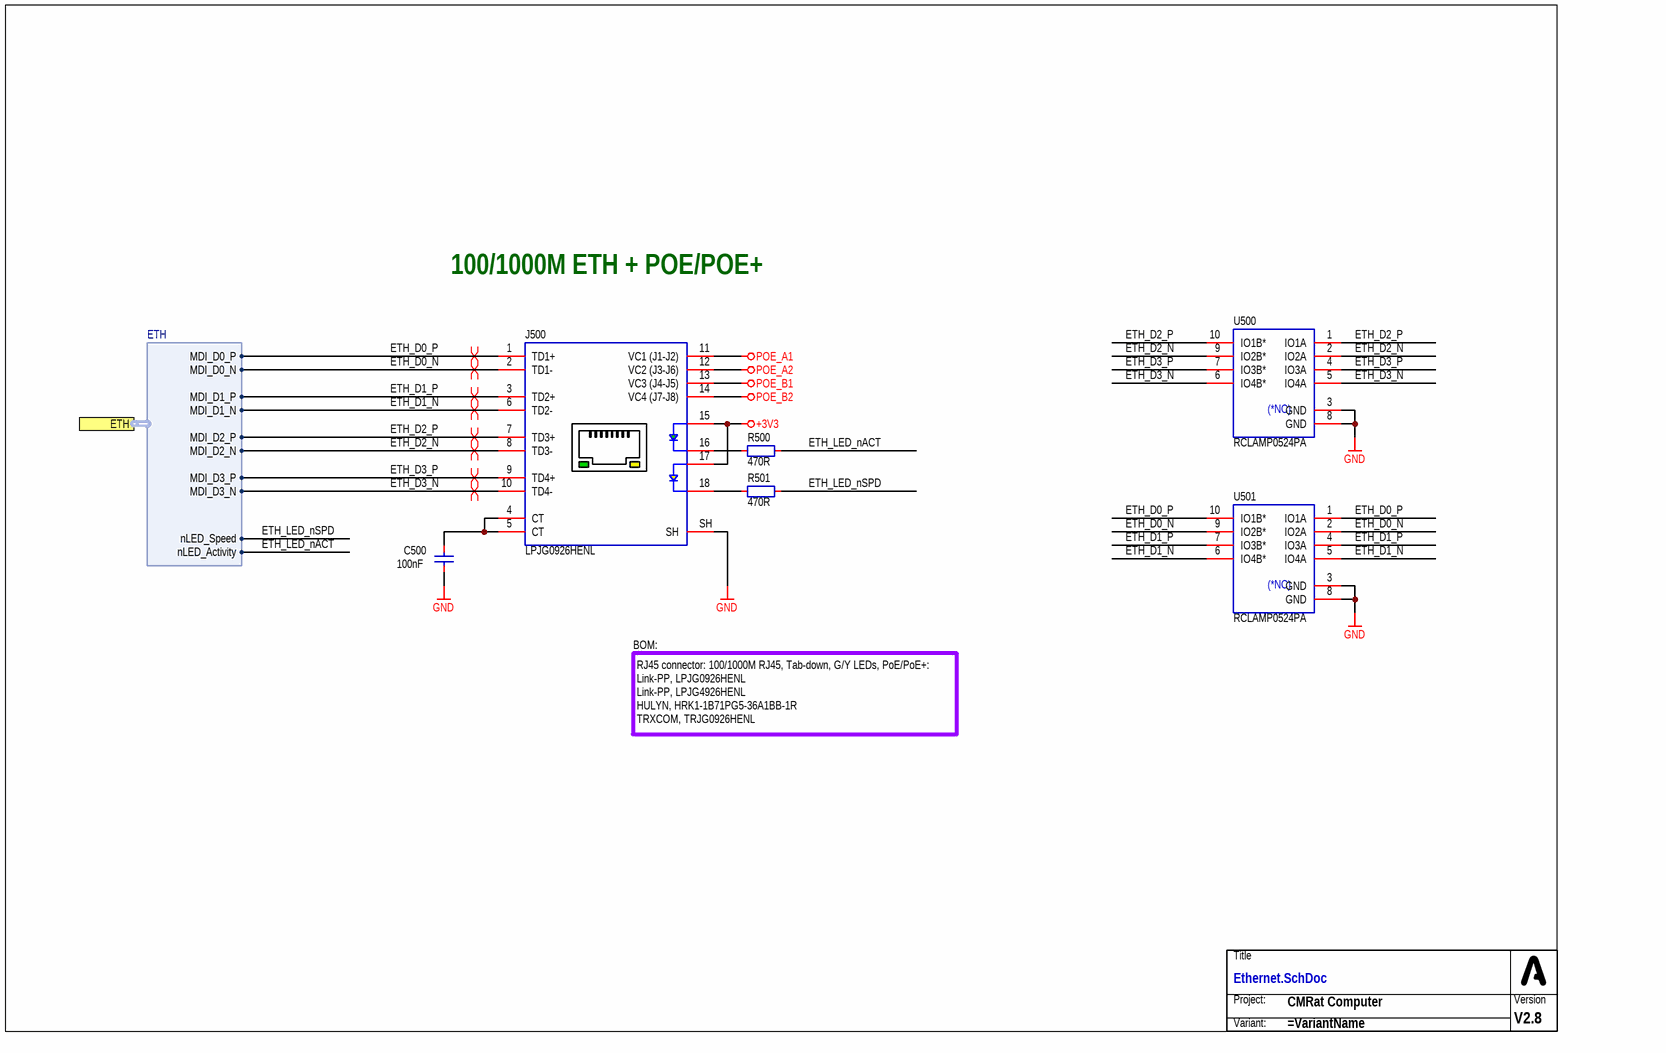
[diagram p5: Ethernet.SchDoc]

### Parts
C500  100nF  [CAP_0603_R]
J500  LPJG0926HENL  [CON_LPP_LPJG0926HENL]
R500  470R  [RES_0603_R]
R501  470R  [RES_0603_R]
TB500  (no value)  (no BOM)
U500  RCLAMP0524PA  [ICC_SLP2510P8_250X100X60_P50_R]
U501  RCLAMP0524PA  [ICC_SLP2510P8_250X100X60_P50_R]

### Ports
ETH (harness ETH)

### Harnesses
ETH: MDI_D0_P, MDI_D0_N, MDI_D1_P, MDI_D1_N, MDI_D2_P, MDI_D2_N, MDI_D3_P, MDI_D3_N, nLED_Speed, nLED_Activity

### Nets
+3V3: J500.15(GRN_A) J500.17(YLW_A)
GND: C500.1 J500.SH U500.3(GND) U500.8(GND) U501.3(GND) U501.8(GND)
POE_A1: J500.11(VC1_(J1-J2))
POE_A2: J500.12(VC2_(J3-J6))
POE_B1: J500.13(VC3_(J4-J5))
POE_B2: J500.14(VC4_(J7-J8))
ETH_D0_N: J500.2(TD1-) U501.2(IO2A) U501.9(IO2B*) ; port ETH.MDI_D0_N
ETH_D0_P: J500.1(TD1+) U501.1(IO1A) U501.10(IO1B*) ; port ETH.MDI_D0_P
ETH_D1_N: J500.6(TD2-) U501.5(IO4A) U501.6(IO4B*) ; port ETH.MDI_D1_N
ETH_D1_P: J500.3(TD2+) U501.4(IO3A) U501.7(IO3B*) ; port ETH.MDI_D1_P
ETH_D2_N: J500.8(TD3-) U500.2(IO2A) U500.9(IO2B*) ; port ETH.MDI_D2_N
ETH_D2_P: J500.7(TD3+) U500.1(IO1A) U500.10(IO1B*) ; port ETH.MDI_D2_P
ETH_D3_N: J500.10(TD4-) U500.5(IO4A) U500.6(IO4B*) ; port ETH.MDI_D3_N
ETH_D3_P: J500.9(TD4+) U500.4(IO3A) U500.7(IO3B*) ; port ETH.MDI_D3_P
ETH_LED_nACT: R500.1 ; port ETH.nLED_Activity
ETH_LED_nSPD: R501.1 ; port ETH.nLED_Speed
NetC500_2: C500.2 J500.4(CT) J500.5(CT)
NetJ500_16: J500.16(GRN_K) R500.2
NetJ500_18: J500.18(YLW_K) R501.2

### Layout directives
differential pair: ETH_D0_N, ETH_D0_P, ETH_D1_N, ETH_D1_P, ETH_D2_N, ETH_D2_P, ETH_D3_N, ETH_D3_P

### Notes on the sheet
- 100/1000M ETH + POE/POE+
- BOM:
- RJ45 connector: 100/1000M RJ45, Tab-down, G/Y LEDs, PoE/PoE+:
  Link-PP, LPJG0926HENL
  Link-PP, LPJG4926HENL
  HULYN, HRK1-1B71PG5-36A1BB-1R
  TRXCOM, TRJG0926HENL
- (in symbol ICC-0005) (*NC)
- (in symbol SCH_TITLE_BLOCK_SIMPLE_NODATE) Title; Project:; Version; Variant:

### Library data of the parts
C500 = CAP-0008: as C304 on sheet PCIe; Component Type: Capacitor; Component Subtype: MLCC; Value: 100nF; Mounting Type: SMD
J500 = CON_LPP_LPJG0926HENL: Connector; RJ45;; Manufacturer: Link-PP; Package (Case): THT; Component Subtype: RJ45; Component Type: Connector; Mounting Type: THT; MPN: LPJG0926HENL; Value: LPJG0926HENL
R500 R501 = RES-0042: Resistor; Thick Film; 470R; 1%; 100mW; 100PPM; 75V; Standard; SMD; 0603 (1608);; Manufacturer: UNI-ROYAL(Uniroyal Elec); MPN: 0603WAF4700T5E; Package (Case): 0603; Component Type: Resistor; Component Subtype: Thick Film; Value: 470R; Mounting Type: SMD
TB500 = SCH_TITLE_BLOCK_SIMPLE_NODATE
U500 U501 = ICC-0005: as U200 on sheet USB_C; Component Type: IC; Component Subtype: TVS Arrays; Value: RCLAMP0524PA; Mounting Type: SMD

## Sheet SD.SchDoc: MicroSD slot
size A4
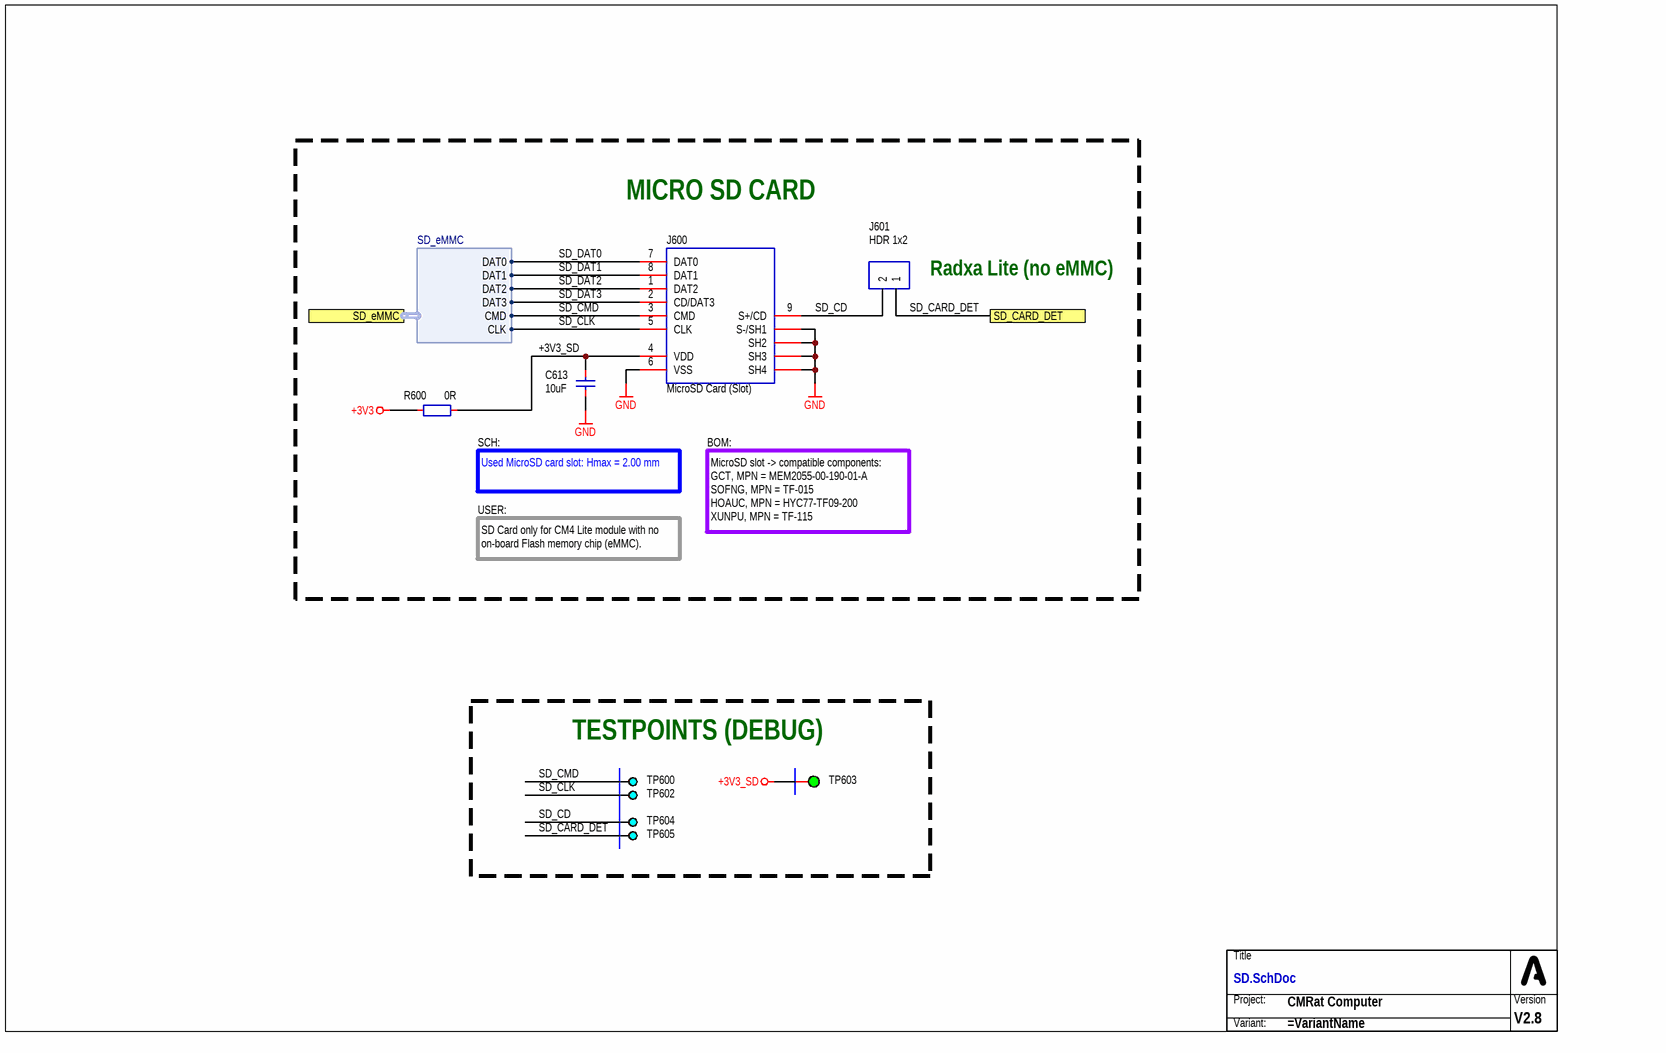
[diagram p6: SD.SchDoc]

### Parts
(Parts that share a designator on the sheet are numbered #1, #2 ... from top to bottom, then left to right.)
C613  10uF  [CAP_0603_R]
J600  MicroSD Card (Slot)  [CON_GCT_MEM2055_R]
J601  HDR 1x2  [CON_HEADER_TMV_1X2_P254H857]
R600  0R  [RES_0603_R]
TB?#4  (no value)  (no BOM)
TP600  DEBUG  [PCB_TP_DBG_50]  (value not drawn)  (no BOM)
TP602  DEBUG  [PCB_TP_DBG_50]  (value not drawn)  (no BOM)
TP603  ICT  [PCB_TP_ICT_100]  (value not drawn)  (no BOM)
TP604  DEBUG  [PCB_TP_DBG_50]  (value not drawn)  (no BOM)
TP605  DEBUG  [PCB_TP_DBG_50]  (value not drawn)  (no BOM)

### Ports
SD_CARD_DET, SD_eMMC (harness SD_eMMC)

### Harnesses
SD_eMMC: DAT0, DAT1, DAT2, DAT3, CMD, CLK

### Nets
+3V3: R600.2
+3V3_SD: C613.2 J600.4(VDD) R600.1 TP603.1
GND: C613.1 J600.6(VSS) J600.SH1(S-/SH1) J600.SH2 J600.SH3 J600.SH4
SD_CARD_DET: J601.1 TP605.1 ; port SD_CARD_DET
SD_CD: J600.9(S+/CD) J601.2 TP604.1
SD_CLK: J600.5(CLK) TP602.1 ; port SD_eMMC.CLK  [project net CM_SD_CLK]
SD_CMD: J600.3(CMD) TP600.1 ; port SD_eMMC.CMD  [project net CM_SD_CMD]
SD_DAT0: J600.7(DAT0) ; port SD_eMMC.DAT0  [project net CM_SD_DAT0]
SD_DAT1: J600.8(DAT1) ; port SD_eMMC.DAT1  [project net CM_SD_DAT1]
SD_DAT2: J600.1(DAT2) ; port SD_eMMC.DAT2  [project net CM_SD_DAT2]
SD_DAT3: J600.2(CD/DAT3) ; port SD_eMMC.DAT3  [project net CM_SD_DAT3]

### Notes on the sheet
- MICRO SD CARD
- (near J601) Radxa Lite (no eMMC)
- (near R600) SCH:
- BOM:
- USER:
- Used MicroSD card slot: Hmax = 2.00 mm
- SD Card only for CM4 Lite module with no on-board Flash memory chip (eMMC).
- MicroSD slot -> compatible components:
  GCT, MPN = MEM2055-00-190-01-A
  SOFNG, MPN = TF-015
  HOAUC, MPN = HYC77-TF09-200
  XUNPU, MPN = TF-115
- TESTPOINTS (DEBUG)
- (in symbol SCH_TITLE_BLOCK_SIMPLE_NODATE) Title; Project:; Version; Variant:

### Library data of the parts
C613 = CAP-0023: as C303 on sheet PCIe; Component Type: Capacitor; Value: 10uF; Mounting Type: SMD
J600 = CON_GCT_MEM2055: Connector; MicroSD Card Connector;; Manufacturer: TF-015; Package (Case): SMD; MPN: TF-015; Value: MicroSD Card (Slot); Component Subtype: MicroSD Card; Component Type: Card Socket; Mounting Type: SMD
J601 = ITEM_J10014: CONN THT / HEADER / PITCH 2,54mm / VERTICAL / (2 PIN); Manufacturer: Ckmtw(Shenzhen Cankemeng); MPN: B-2100S02P-A110; Component Subtype: Pin Header; Mounting Type: THT; Component Type: Connector; Package (Case): THT; Value: HDR 1x2
R600 = RES-0054: Resistor; Thick Film; 0R; SMD; 0603 (1608);; Manufacturer: UNI-ROYAL(Uniroyal Elec); MPN: 0603WAF0000T5E; Package (Case): 0603; Component Type: Resistor; Component Subtype: Thick Film; Value: 0R; Mounting Type: SMD
TB?#4 = SCH_TITLE_BLOCK_SIMPLE_NODATE
TP600 TP602 TP604 TP605 = PCB_TP_DBG: PCB Marking; Test Point (Debug);; Value: DEBUG; Component Type: Testpoint
TP603 = PCB_TP_ICT: Test Point (ICT); Component Type: Testpoint (for ICT); Mounting Type: Non component; Value: ICT

## Sheet PWR.SchDoc: Power
size A3
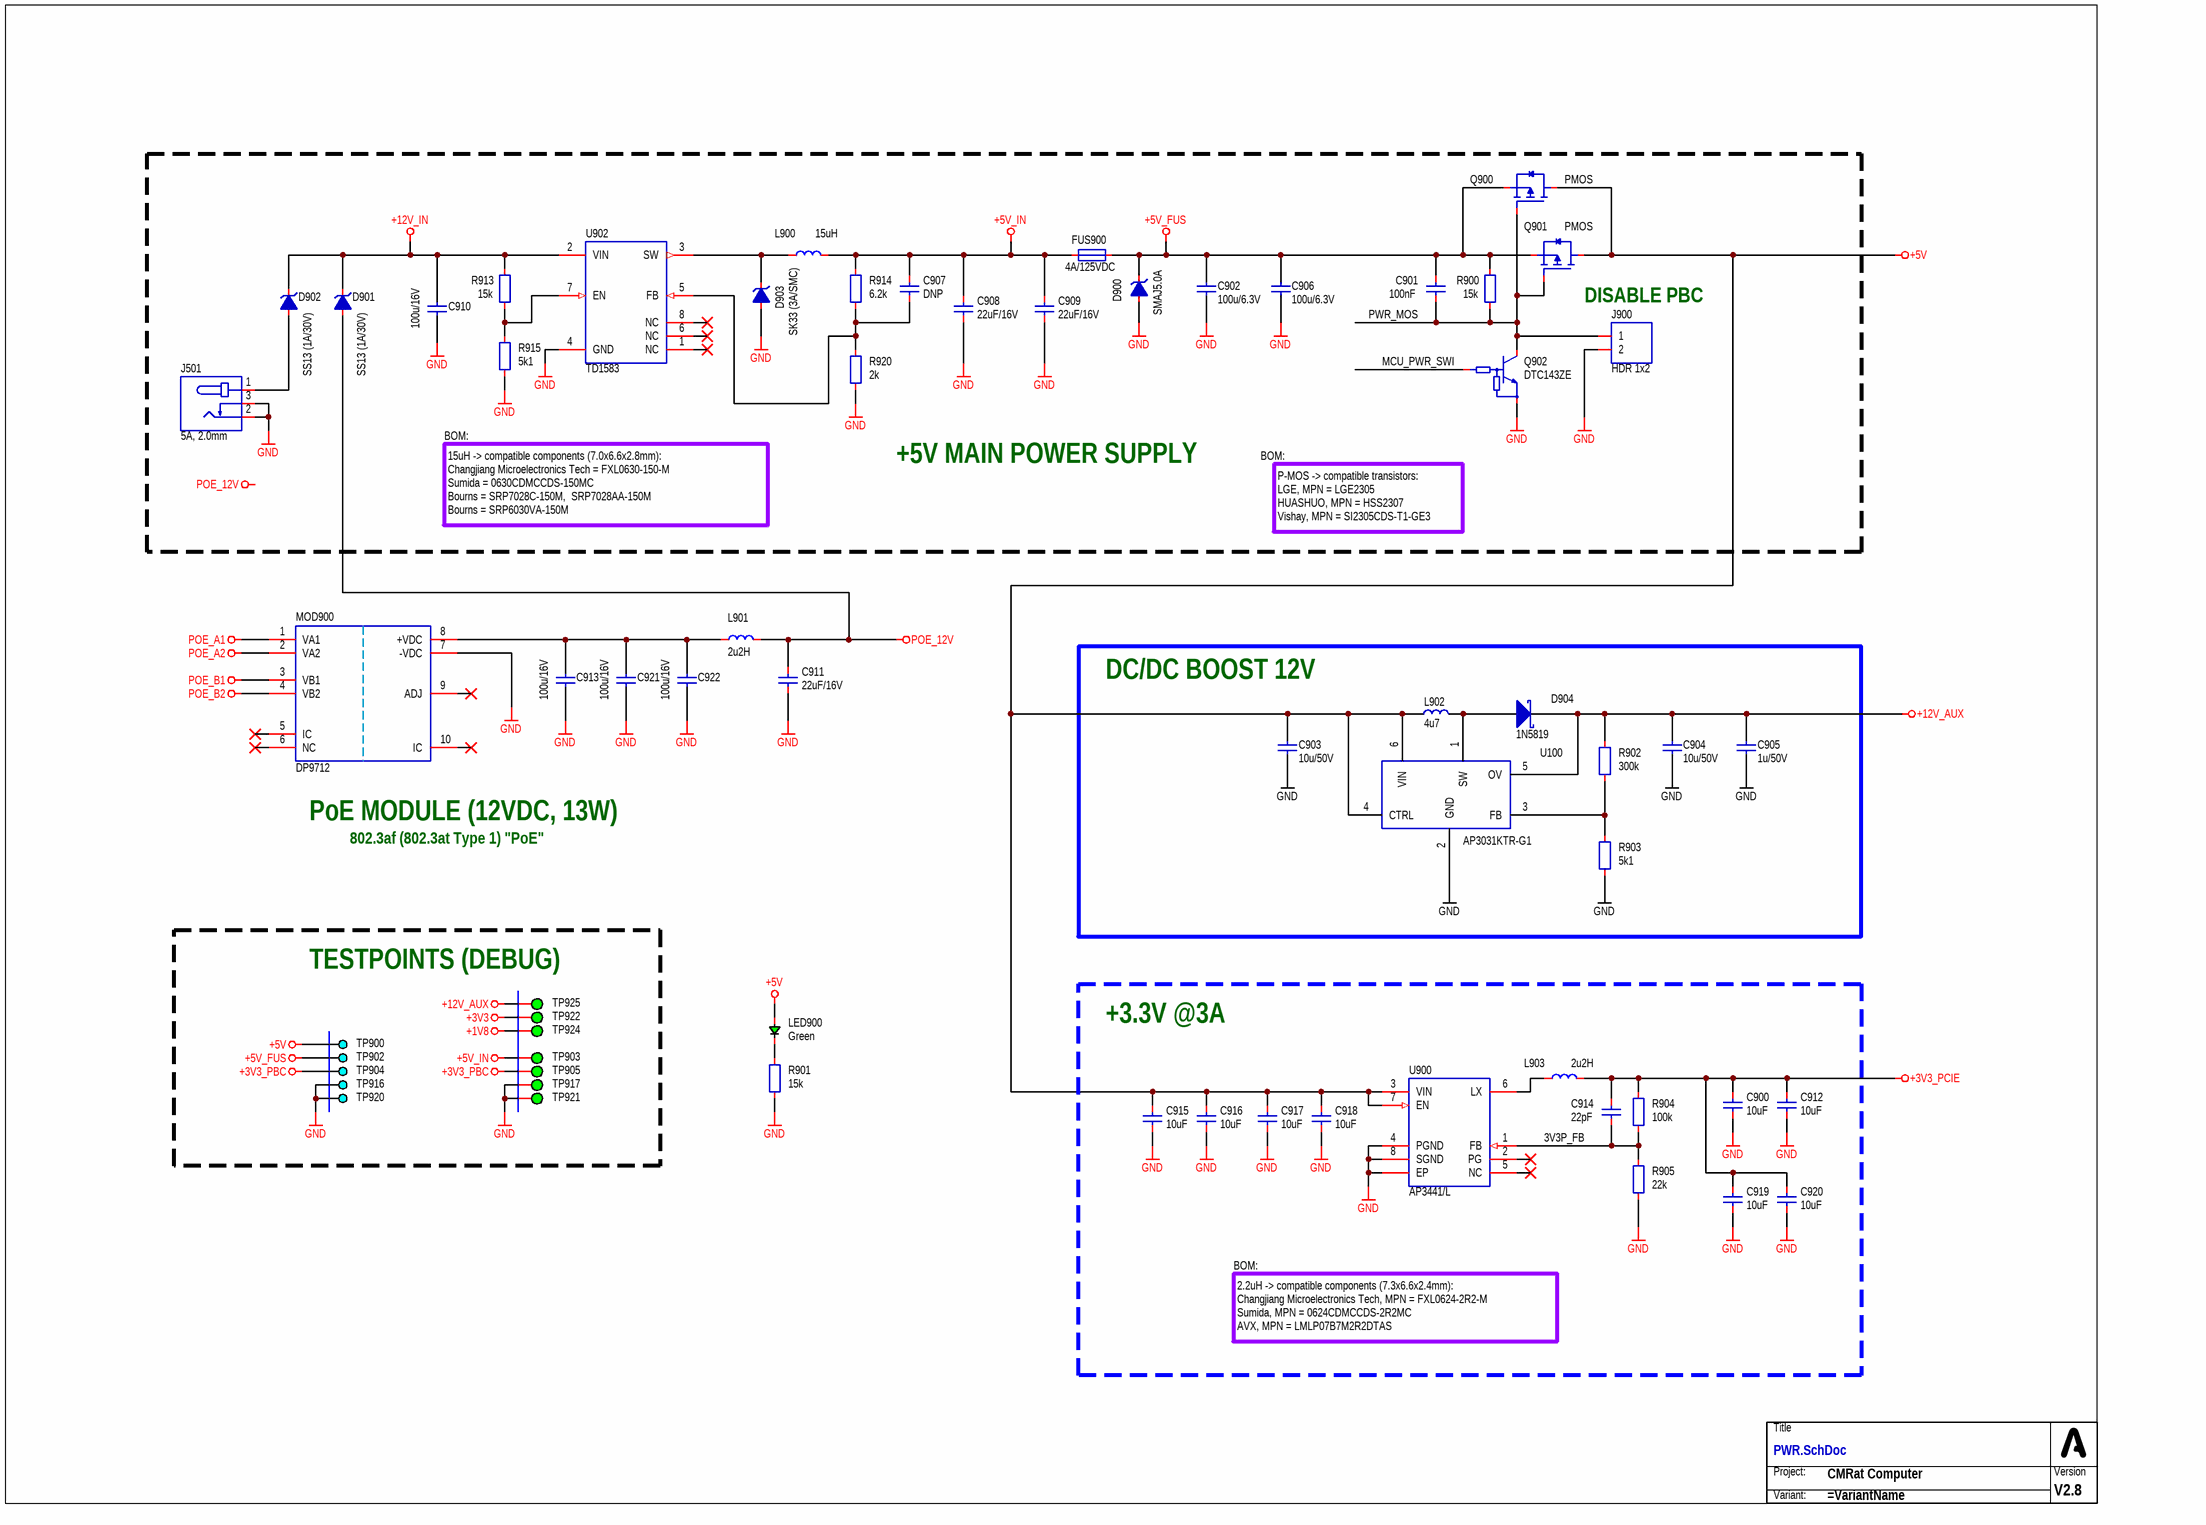
[diagram p7: PWR.SchDoc]

### Parts
(Parts that share a designator on the sheet are numbered #1, #2 ... from top to bottom, then left to right.)
C900  10uF  [CAP_0603_R]
C901  100nF  [CAP_0603_R]
C902  100u/6.3V  [CAP_1206_H190_R]
C903  10u/50V  [CAP_1206_H190_R]
C904  10u/50V  [CAP_1206_H190_R]
C905  1u/50V  [CAP_0603_R]
C906  100u/6.3V  [CAP_1206_H190_R]
C907  DNP  [CAP_0603_R]
C908  22uF/16V  [CAP_0805_R]
C909  22uF/16V  [CAP_0805_R]
C910  100u/16V  [CAP_1210_H280_R]
C911  22uF/16V  [CAP_0805_R]
C912  10uF  [CAP_0603_R]
C913  100u/16V  [CAP_1210_H280_R]
C914  22pF  [CAP_0603_R]
C915  10uF  [CAP_0603_R]
C916  10uF  [CAP_0603_R]
C917  10uF  [CAP_0603_R]
C918  10uF  [CAP_0603_R]
C919  10uF  [CAP_0603_R]
C920  10uF  [CAP_0603_R]
C921  100u/16V  [CAP_1210_H280_R]
C922  100u/16V  [CAP_1210_H280_R]
D900  SMAJ5.0A  [DIO_SMA_UNI_R]
D901  SS13 (1A/30V)  [DIO_SMA_UNI_R]
D902  SS13 (1A/30V)  [DIO_SMA_UNI_R]
D903  SK33 (3A/SMC)  [DIO_SMC_UNI_R]
D904  1N5819  [DIO_SOD-323_R]
FUS900  4A/125VDC  [FUS_2410_R]
J501  5A, 2.0mm  [CON_XKB_DC-005-5A-2.0]
J900  HDR 1x2  [CON_HDR_P254_1X02_STR]
L900  15uH  [IND_SUM_0630CDMCCDS_700X660X280_R]
L901  2u2H  [IND_SUM_0624CDMCCDS_700X660X240_R]
L902  4u7  [IND_POWER_0402_R]
L903  2u2H  [IND_SUM_0624CDMCCDS_700X660X240_R]
LED900  Green  [LED_0805_GRN_R]
MOD900  DP9712  [MOD_SDP_DP9700]
Q900  PMOS  [PKG_SOT23-3_TO236]
Q901  PMOS  [PKG_SOT23-3_TO236]
Q902  DTC143ZE  [PKG_SOT523_SC75_SOT416_P100_R]
R900  15k  [RES_0603_R]
R901  15k  [RES_0603_R]
R902  300k  [RES_0603_R]
R903  5k1  [RES_0603_R]
R904  100k  [RES_0603_R]
R905  22k  [RES_0603_R]
R913  15k  [RES_0603_R]
R914  6.2k  [RES_0603_R]
R915  5k1  [RES_0603_R]
R920  2k  [RES_0603_R]
TB?#5  (no value)  (no BOM)
TP900  DEBUG  [PCB_TP_DBG_50]  (value not drawn)  (no BOM)
TP902  DEBUG  [PCB_TP_DBG_50]  (value not drawn)  (no BOM)
TP903  ICT  [PCB_TP_ICT_100]  (value not drawn)  (no BOM)
TP904  DEBUG  [PCB_TP_DBG_50]  (value not drawn)  (no BOM)
TP905  ICT  [PCB_TP_ICT_100]  (value not drawn)  (no BOM)
TP916  DEBUG  [PCB_TP_DBG_50]  (value not drawn)  (no BOM)
TP917  ICT  [PCB_TP_ICT_100]  (value not drawn)  (no BOM)
TP920  DEBUG  [PCB_TP_DBG_50]  (value not drawn)  (no BOM)
TP921  ICT  [PCB_TP_ICT_100]  (value not drawn)  (no BOM)
TP922  ICT  [PCB_TP_ICT_100]  (value not drawn)  (no BOM)
TP924  ICT  [PCB_TP_ICT_100]  (value not drawn)  (no BOM)
TP925  ICT  [PCB_TP_ICT_100]  (value not drawn)  (no BOM)
U100  AP3031KTR-G1  [PKG_SOT23-6_R]
U900  AP3441/L  [ICC_DFN8_200X200X90P50_EP_R]
U902  TD1583  [ICC_SO8_SOP8_490X390X160_P127_R]

### Blocks framed on the sheet
DC/DC BOOST 12V: C903-C905 D904 L902 R902 R903 U100

### Nets
+1V8: TP924.1
+3V3: TP922.1
+3V3_PBC: TP904.1 TP905.1
+3V3_PCIE: C900.2 C912.2 C914.2 C919.2 C920.2 L903.2 R904.2
+5V: C903.2 C915.2 C916.2 C917.2 C918.2 L902.1 LED900.2 Q900.3(D) Q901.3(D) TP900.1 U100.4(CTRL) U100.6(VIN) U900.3(VIN) U900.7(EN)
+5V_FUS: C901.2 C902.2 C906.2 D900.1(K) FUS900.2 Q900.2(S) Q901.2(S) R900.2 TP902.1
+5V_IN: C907.2 C908.2 C909.2 FUS900.1 L900.2 R914.2 TP903.1
+12V_AUX: C904.2 C905.1 D904.K R902.1 TP925.1 U100.5(OV)
+12V_IN: C910.2 D901.1(K) D902.1(K) R913.2 U902.2(VIN)
GND: C900.1 C902.1 C903.1 C904.1 C905.2 C906.1 C908.1 C909.1 C910.1 C911.1 C912.1 C913.1 C915.1 C916.1 C917.1 C918.1 C919.1 C920.1 C921.1 C922.1 D900.2(A) D903.2(A) J501.2 J501.3 J900.2 MOD900.7(-VDC) Q902.2(E) R901.1 R903.2 R905.1 R915.2 R920.2 TP916.1 TP917.1 TP920.1 TP921.1 U100.2(GND) U900.4(PGND) U900.8(SGND) U900.EP U902.4(GND)
POE_12V: C911.2 D901.2(A) L901.2
POE_A1: MOD900.1(VA1)
POE_A2: MOD900.2(VA2)
POE_B1: MOD900.3(VB1)
POE_B2: MOD900.4(VB2)
3V3P_FB: C914.1 R904.1 R905.2 U900.1(FB)
MCU_PWR_SWI: Q902.1(B)
PWR_MOS: C901.1 J900.1 Q900.1(G) Q901.1(G) Q902.3(C) R900.1
NetC907_1: C907.1 R914.1 R920.1 U902.5(FB)
NetC913_2: C913.2 C921.2 C922.2 L901.1 MOD900.8(+VDC)
NetD902_2: D902.2(A) J501.1
NetD903_1: D903.1(K) L900.1 U902.3(SW)
NetD904_A: D904.A L902.2 U100.1(SW)
NetL903_1: L903.1 U900.6(LX)
NetLED900_1: LED900.1 R901.2
NetR902_2: R902.2 R903.1 U100.3(FB)
NetR913_1: R913.1 R915.1 U902.7(EN)

Not connected (* = marked no-connect by the designer): MOD900 5(IC)* 6(NC)* 9(ADJ)* 10(IC)*; U900 2(PG)* 5(NC)*; U902 1(NC)* 6(NC)* 8(NC)*

### Notes on the sheet
- (near Q901) DISABLE PBC
- BOM:
- +5V MAIN POWER SUPPLY
- 15uH -> compatible components (7.0x6.6x2.8mm):
  Changjiang Microelectronics Tech = FXL0630-150-M
  Sumida = 0630CDMCCDS-150MC
  Bourns = SRP7028C-150M,  SRP7028AA-150M
  Bourns = SRP6030VA-150M
- P-MOS -> compatible transistors:
  LGE, MPN = LGE2305
  HUASHUO, MPN = HSS2307
  Vishay, MPN = SI2305CDS-T1-GE3
- (near MOD900) PoE MODULE (12VDC, 13W)
- 802.3af (802.3at Type 1) "PoE"
- TESTPOINTS (DEBUG)
- +3.3V @3A
- 2.2uH -> compatible components (7.3x6.6x2.4mm):
  Changjiang Microelectronics Tech, MPN = FXL0624-2R2-M
  Sumida, MPN = 0624CDMCCDS-2R2MC
  AVX, MPN = LMLP07B7M2R2DTAS
- Labels drawn without touching a wire or pin: POE_12V
- (in symbol SCH_TITLE_BLOCK_SIMPLE_NODATE) Title; Project:; Version; Variant:

### Library data of the parts
C900 C912 C915-C920 = CAP-0023: as C303 on sheet PCIe; Component Type: Capacitor; Value: 10uF; Mounting Type: SMD
C901 = CAP-0008: as C304 on sheet PCIe; Component Type: Capacitor; Component Subtype: MLCC; Value: 100nF; Mounting Type: SMD
C902 C906 = ITEM_C10039: CAP SMD 100u/6.3V ±20% 6.3V X5R (1206); Manufacturer: Samsung Electro-Mechanics; MPN: CL31A107MQHNNNE; Component Subtype: MLCC; Package (Case): 1206; Component Type: Capacitor; Mounting Type: SMD; Value: 100u/6.3V
C903 C904 = ITEM_C10004: CAP SMD 10u/50V ±10% 50V X5R (1206); Manufacturer: Samsung Electro-Mechanics; MPN: CL31A106KBHNNNE; Component Subtype: MLCC; Package (Case): 1206; Component Type: Capacitor; Mounting Type: SMD; Value: 10u/50V
C905 = ITEM_C10014: CAP SMD 1u/50V ±10% 50V X5R (0603); Manufacturer: Samsung Electro-Mechanics; MPN: CL10A105KB8NNNC; Component Subtype: MLCC; Package (Case): 0603; Component Type: Capacitor; Mounting Type: SMD; Value: 1u/50V
C907 = CAP-0018: Component Subtype: MLCC; Package (Case): 0603; Component Type: Capacitor; Value: DNP; Mounting Type: SMD
C908 C909 C911 = CAP-0024: as C200 on sheet USB_C; Component Type: Capacitor; Component Subtype: MLCC; Value: 22uF/16V; Mounting Type: SMD
C910 C913 C921 C922 = ITEM_C10033: CAP SMD 100u/16V ±20% 16V X5R (1210); Manufacturer: Chinocera; MPN: HGC1210R5107M160NSVK; Component Subtype: MLCC; Package (Case): 1210; Value: 100uF; Component Type: Capacitor; Mounting Type: SMD
C914 = CAP-0023: Capacitor; MLCC; 22p 50V; Manufacturer: Samsung Electro-Mechanics; MPN: CL10C220JB8NNNC; Package (Case): 0603; Component Type: Capacitor; Component Subtype: MLCC; Value: 22pF; Mounting Type: SMD
D900 = DIO_TVS_UNI_KA: Diode; Schottky; Unipolar; SMAj5.0A; Manufacturer: Littelfuse; Component Subtype: TVS Diode; Package (Case): SMA; Value: SMAJ5.0A; MPN: SMAJ5.0A; Component Type: Diode; Mounting Type: SMD
D901 D902 = DIO_TVS_UNI_KA: Diode; Schottky; Unipolar; SS13; Manufacturer: ON Semi; Component Subtype: TVS Diode; Package (Case): DO-214AC (SMA); Value: SS13 (1A/30V); MPN: SS13; Component Type: Diode; Mounting Type: SMD
D903 = DIO_TVS_UNI_KA: Diode; Schottky; Unipolar; SK33; Manufacturer: Littelfuse; Component Subtype: TVS Diode; Package (Case): SMC; Value: SK33 (3A/SMC); MPN: SK33; Component Type: Diode; Mounting Type: SMD
D904 = ITEM_D10006: DIODE SMD / SCHOTTKY / 40V 1A 600mV @ 1A  (SOD-323); Manufacturer: Guangdong Hottech; MPN: 1N5819WS; Package (Case): SOD-323
FUS900 = FUS: Fuse 4A; Manufacturer: Bel Fuse; MPN: 0679L4000-01; Package (Case): SMD,6.1x2.5mm; Value: 4A/125VDC; Mounting Type: SMD
J501 = CON_XKB_DC-005-5A-2.0: Connector; DC Barrel Jack;; Manufacturer: XKB Connectivity; Package (Case): THT; Component Subtype: DC Barrel Jack; Component Type: Connector; Mounting Type: THT; MPN: DC-005-5A-2.0; Value: 5A, 2.0mm
J900 = CON-0020: as J201 on sheet USB_C; Component Type: Connector; Value: HDR 1x2; Mounting Type: THT; Package (Case): THT
L900 = IND: Inductor; 15u; Manufacturer: Changjiang Microelectronics Tech; MPN: FXL0630-150-M; Component Subtype: Power Inductor; Package (Case): SMD; Value: 15uH; Component Type: Inductor; Mounting Type: SMD
L901 L903 = IND: Inductor; 2u2; Manufacturer: Changjiang Microelectronics Tech; MPN: FXL0624-2R2-M; Component Subtype: Power Inductor; Package (Case): SMD; Value: 2u2H; Component Type: Inductor; Mounting Type: SMD
L902 = ITEM_L10009: INDUCTOR SMD COIL / 4u7 ±20% / Power inductor Ir 2.8A Isat 3A (SMD,4.2x4.4mm); Manufacturer: cjiang (Changjiang Microelectronics Tech); MPN: FXL0420-4R7-M; Component Subtype: Power Inductor; Component Type: Inductor; Mounting Type: SMD; Package (Case): SMD,4.2x4.4mm; Value: 4u7
LED900 = DIO_LED_GRN: Diode; LED; Green;; Manufacturer: Foshan NationStar Optoelectronics; MPN: NCD0805G1; Component Subtype: LED Diode; Package (Case): 0805; Value: Green; Component Type: LED; Mounting Type: SMD
MOD900 = MOD_SDP_DP9700: PCB Module; PoE Module;; Manufacturer: SDaPo; Component Type: PCB Module; Mounting Type: THT; MPN: DP9712; Value: DP9712
Q900 Q901 = TRA_PMOS_GSD: Transistor; PMOS;; Manufacturer: Vishay; MPN: SI2305CDS-T1-GE3; Component Subtype: P-MOSFET; Package (Case): SOT23; Value: PMOS; Component Type: Transistor; Mounting Type: SMD
Q902 = TRA_BJT_NPN_DIG_BEC: as Q200 on sheet USB_C; Value: DTC143ZE; MPN: DTC143ZE; Component Type: Transistor; Mounting Type: SMD
R900 R901 R913 = RES-0043: as R202 on sheet USB_C; Component Type: Resistor; Component Subtype: Thick Film; Value: 15k; Mounting Type: SMD
R902 = RES-0043: Resistor; Thick Film; 5k1; 1%; 100mW; 100PPM; 75V; Standard; SMD; 0603 (1608);; Manufacturer: UNI-ROYAL(Uniroyal Elec); MPN: 0603WAF3003T5E; Package (Case): 0603; Component Type: Resistor; Component Subtype: Thick Film; Value: 300k; Mounting Type: SMD
R903 R915 = RES-0043: as R100 on sheet CM_MODULE; Component Type: Resistor; Component Subtype: Thick Film; Value: 5k1; Mounting Type: SMD
R904 = RES-0029: as R206 on sheet USB_C; Component Type: Resistor; Component Subtype: Thick Film; Value: 100k; Mounting Type: SMD
R905 = RES-0034: Resistor; Thick Film; 22k; 1%; 100mW; 100PPM; 75V; Standard; SMD; 0603 (1608);; Manufacturer: UNI-ROYAL(Uniroyal Elec); MPN: 0603WAF2202T5E; Package (Case): 0603; Component Type: Resistor; Component Subtype: Thick Film; Value: 22k; Mounting Type: SMD
R914 = RES-0054: Resistor; Thick Film; 6k2; SMD; 0603 (1608);; Manufacturer: UNI-ROYAL(Uniroyal Elec); MPN: 0603WAF6201T5E; Package (Case): 0603; Component Type: Resistor; Component Subtype: Thick Film; Value: 6.2k; Mounting Type: SMD
R920 = RES-0033: Resistor; Thick Film; 2k2; 1%; 100mW; 100PPM; 75V; Standard; SMD; 0603 (1608);; Manufacturer: UNI-ROYAL(Uniroyal Elec); MPN: 0603WAF2001T5E; Package (Case): 0603; Component Type: Resistor; Component Subtype: Thick Film; Value: 2k; Mounting Type: SMD
TB?#5 = SCH_TITLE_BLOCK_SIMPLE_NODATE
TP900 TP902 TP904 TP916 TP920 = PCB_TP_DBG: PCB Marking; Test Point (Debug);; Value: DEBUG; Component Type: Testpoint
TP903 TP905 TP917 TP921 TP922 TP924 TP925 = PCB_TP_ICT: Test Point (ICT); Component Type: Testpoint (for ICT); Mounting Type: Non component; Value: ICT
U100 = ITEM_U10019: IC SMD / REGULATOR - CONVERTER (INT SWI) - DC/DC - STEP-UP / 1.4A 2.7-16VIN 1MHz (SOT-23-6); Manufacturer: Diodes Incorporated; MPN: AP3031KTR-G1; Package (Case): SOT-23-6
U900 = ICC_DDS_AP3441/L_DFN2020-8: IC; Buck regulator; AP3441; Manufacturer: Diodes Incorporated; MPN: AP3441SHE-7B; Package (Case): U-DFN2020-8; Component Type: IC; Mounting Type: SMD; Value: AP3441/L
U902 = ICC_TCH_TD1583_SOP8: IC; Buck regulator; TD1583; Manufacturer: Techcode Semicon; MPN: TD1583PR; Package (Case): SOP8; Component Type: IC; Mounting Type: SMD; Value: TD1583

## Sheet MISC.SchDoc: MISC
size A4
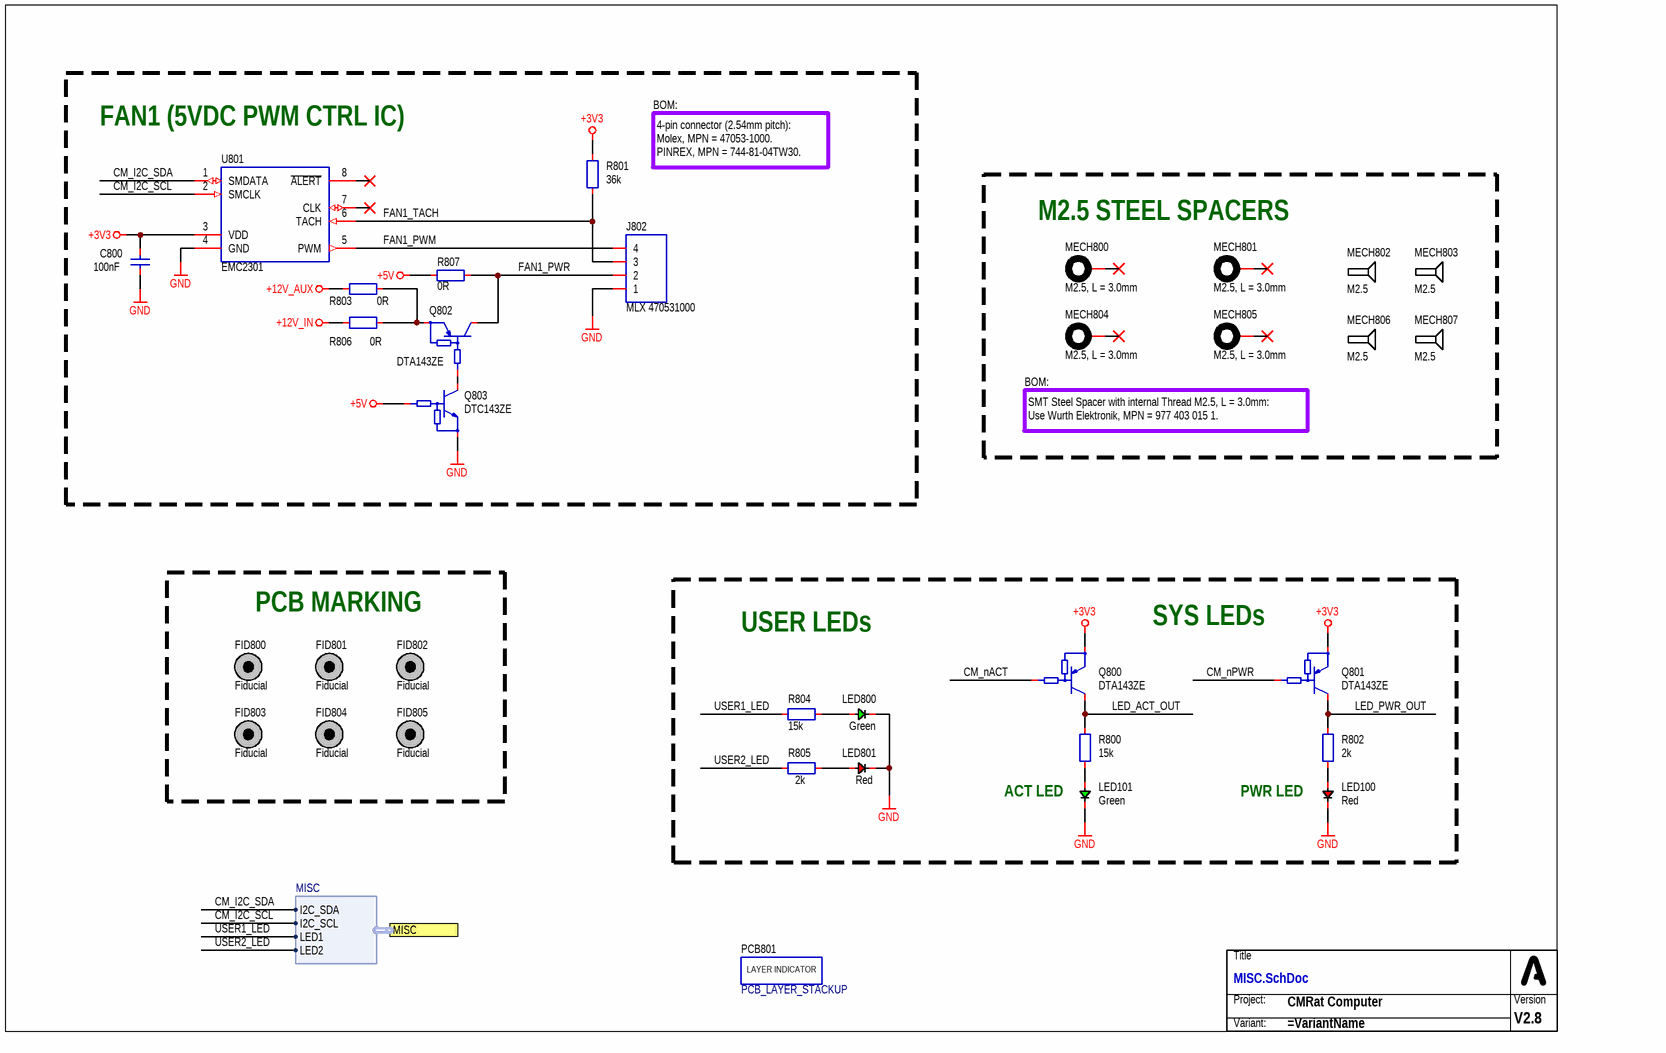
[diagram p8: MISC.SchDoc]

### Parts
C800  100nF  [CAP_0603_R]
FID800  Fiducial  [PCB_FID_RND_100x300]  (no BOM)
FID801  Fiducial  [PCB_FID_RND_100x300]  (no BOM)
FID802  Fiducial  [PCB_FID_RND_100x300]  (no BOM)
FID803  Fiducial  [PCB_FID_RND_100x300]  (no BOM)
FID804  Fiducial  [PCB_FID_RND_100x300]  (no BOM)
FID805  Fiducial  [PCB_FID_RND_100x300]  (no BOM)
J802  MLX 470531000  [CON_MLX_470531000]
LED100  Red  [LED_0805_RED_R]
LED101  Green  [LED_0805_GRN_R]
LED800  Green  [LED_0805_GRN_R]
LED801  Red  [LED_0805_RED_R]
MECH800  M2.5, L = 3.0mm  [PCB_WRT_9774030151]
MECH801  M2.5, L = 3.0mm  [PCB_WRT_9774030151]
MECH802  M2.5  (mechanical)
MECH803  M2.5  (mechanical)
MECH804  M2.5, L = 3.0mm  [PCB_WRT_9774030151]
MECH805  M2.5, L = 3.0mm  [PCB_WRT_9774030151]
MECH806  M2.5  (mechanical)
MECH807  M2.5  (mechanical)
PCB801  PCB_LAYER_STACKUP  [PCB_STACKUP-4L_A2]  (no BOM)
Q800  DTA143ZE  [PKG_SOT523_SC75_SOT416_P100_R]
Q801  DTA143ZE  [PKG_SOT523_SC75_SOT416_P100_R]
Q802  DTA143ZE  [PKG_SOT523_SC75_SOT416_P100_R]
Q803  DTC143ZE  [PKG_SOT523_SC75_SOT416_P100_R]
R800  15k  [RES_0603_R]
R801  36k  [RES_0603_R]
R802  2k  [RES_0603_R]
R803  0R  [RES_0603_R]
R804  15k  [RES_0603_R]
R805  2k  [RES_0603_R]
R806  0R  [RES_0603_R]
R807  0R  [RES_0603_R]
TB800  (no value)  (no BOM)
U801  EMC2301  [ICC_TSSOP8_300X300X110P65]

### Ports
MISC (harness MISC)

### Harnesses
MISC: I2C_SDA, I2C_SCL, LED1, LED2

### Nets
+3V3: C800.2 Q800.2(E) Q801.2(E) R801.2 U801.3(VDD)
+5V: Q803.1(B) R807.2
+12V_AUX: R803.2
+12V_IN: R806.2
GND: C800.1 J802.1 LED100.1 LED101.1 LED800.1 LED801.1 Q803.2(E) U801.4(GND)
CM_I2C_SCL: U801.2(SMCLK) ; port MISC.I2C_SCL
CM_I2C_SDA: U801.1(SMDATA) ; port MISC.I2C_SDA
CM_nACT: Q800.1(B)
CM_nPWR: Q801.1(B)
FAN1_PWM: J802.4 U801.5(PWM)
FAN1_PWR: J802.2 Q802.3(C) R807.1
FAN1_TACH: J802.3 R801.1 U801.6(TACH)
LED_ACT_OUT: Q800.3(C) R800.2
LED_PWR_OUT: Q801.3(C) R802.2
USER1_LED: R804.1 ; port MISC.LED1
USER2_LED: R805.1 ; port MISC.LED2
NetLED100_2: LED100.2 R802.1
NetLED101_2: LED101.2 R800.1
NetLED800_2: LED800.2 R804.2
NetLED801_2: LED801.2 R805.2
NetQ802_1: Q802.1(B) Q803.3(C)
NetQ802_2: Q802.2(E) R803.1 R806.1

Not connected (* = marked no-connect by the designer): MECH800 1*; MECH801 1*; MECH804 1*; MECH805 1*; U801 7(CLK)* 8(~{ALERT})*

### Notes on the sheet
- BOM:
- (near U801) FAN1 (5VDC PWM CTRL IC)
- 4-pin connector (2.54mm pitch):
  Molex, MPN = 47053-1000.
  PINREX, MPN = 744-81-04TW30.
- M2.5 STEEL SPACERS
- SMT Steel Spacer with internal Thread M2.5, L = 3.0mm:
  Use Wurth Elektronik, MPN = 977 403 015 1.
- PCB MARKING
- USER LEDs
- (near Q801) SYS LEDs
- ACT LED
- PWR LED
- (in symbol PCB_LAYER_STACKUP) LAYER INDICATOR
- (in symbol SCH_TITLE_BLOCK_SIMPLE_NODATE) Title; Project:; Version; Variant:

### Library data of the parts
C800 = CAP-0008: as C304 on sheet PCIe; Component Type: Capacitor; Component Subtype: MLCC; Value: 100nF; Mounting Type: SMD
FID800-FID805 = PCB_FID_RND: PCB Marking; Fiducial; Round;; Value: Fiducial; Component Type: Fiducial
J802 = CON_1X04_COL: Connector; 1 Row; 470531000; Manufacturer: Molex; Component Subtype: Pin header; Package (Case): THT; Component Type: Connector; Mounting Type: THT; MPN: 470531000; Value: MLX 470531000
LED100 LED801 = DIO_LED_RED: Diode; LED; Red;; Manufacturer: Foshan NationStar Optoelectronics; MPN: NCD0805R1; Component Subtype: LED Diode; Package (Case): 0805; Value: Red; Component Type: LED; Mounting Type: SMD
LED101 LED800 = DIO_LED_GRN: as LED900 on sheet PWR; Value: Green; Component Type: LED; Mounting Type: SMD
MECH800 MECH801 MECH804 MECH805 = PCB_MECH_WRT_WA-SMSI: PCB; Mechanical; SMT Steel Spacer; M2.5;; Manufacturer: Wurth Elektronik; MPN: 977 403 015 1; Component Subtype: SMD Spacer; Package (Case): SMD; Value: M2.5, L = 3.0mm; Component Type: Spacer (Standoff); Mounting Type: SMD
MECH802 MECH803 MECH806 MECH807 = PCB_MECH_SCR: Mechnical; Screw;; MPN: M2.5 screw; Value: M2.5
Q800-Q802 = TRA_BJT_PNP_DIG_ONS_DTA143ZE: Transistor; BJT; PNP; Digital;; Manufacturer: On Semiconductor; Component Subtype: PNPTransistor; Package (Case): SOT-523; Component Type: Transistor; Mounting Type: SMD; MPN: DTA143ZE; Value: DTA143ZE
Q803 = TRA_BJT_NPN_DIG_BEC: as Q200 on sheet USB_C; Value: DTC143ZE; MPN: DTC143ZE; Component Type: Transistor; Mounting Type: SMD
R800 R804 = RES-0043: as R202 on sheet USB_C; Component Type: Resistor; Component Subtype: Thick Film; Value: 15k; Mounting Type: SMD
R801 = RES-0054: Resistor; Thick Film; 36k; SMD; 0603 (1608);; Manufacturer: UNI-ROYAL(Uniroyal Elec); MPN: 0603WAF3602T5E; Package (Case): 0603; Component Type: Resistor; Component Subtype: Thick Film; Value: 36k; Mounting Type: SMD
R802 R805 = RES-0033: as R920 on sheet PWR; Component Type: Resistor; Component Subtype: Thick Film; Value: 2k; Mounting Type: SMD
R803 R806 R807 = RES-0054: as R600 on sheet SD; Component Type: Resistor; Component Subtype: Thick Film; Value: 0R; Mounting Type: SMD
TB800 = SCH_TITLE_BLOCK_SIMPLE_NODATE
U801 = ICC_MCP_EMC2301_MSOP-8: IC; Fan controller;; Manufacturer: Microchip Technology; MPN: EMC2301-1-ACZL-TR; Package (Case): MSOP-8; Component Subtype: Fan controller; Component Type: IC; Mounting Type: SMD; Value: EMC2301
PCB801 = PCB_LAYER_STACKUP: Component Type: PCB Marking

## Sheet HDMI.SchDoc: HDMI Interface
size A4
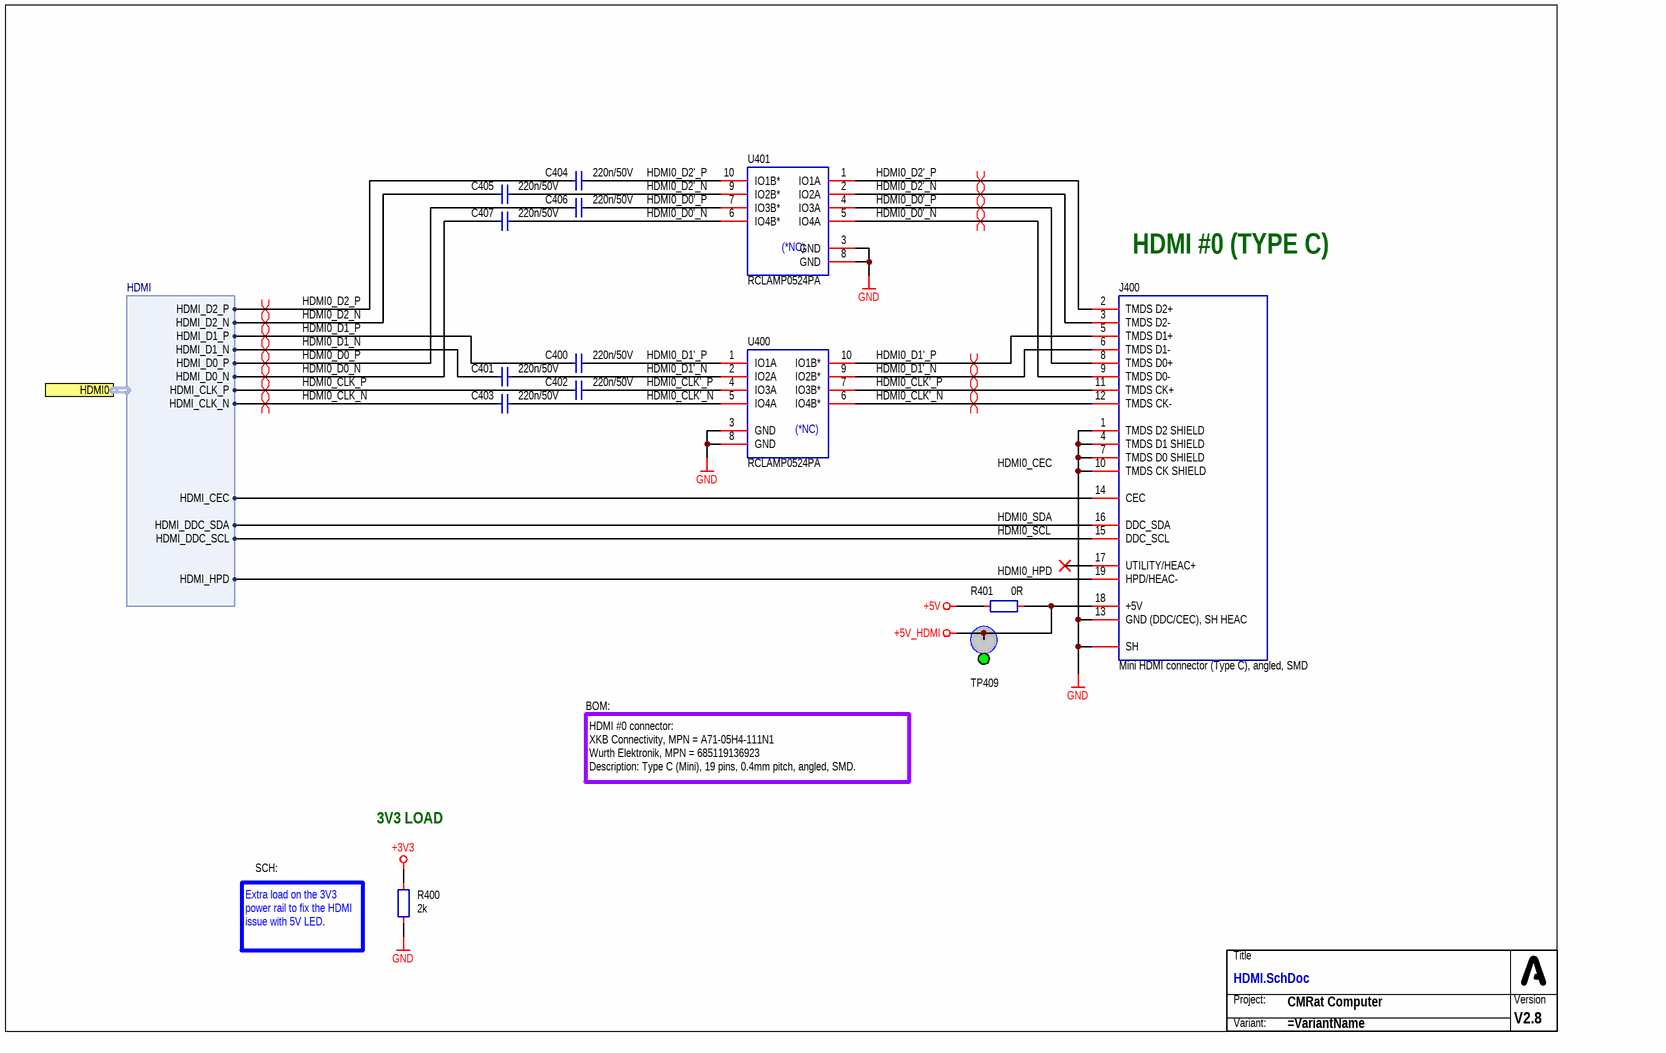
[diagram p9: HDMI.SchDoc]

### Parts
C400  220n/50V  [CAP_0402_R]
C401  220n/50V  [CAP_0402_R]
C402  220n/50V  [CAP_0402_R]
C403  220n/50V  [CAP_0402_R]
C404  220n/50V  [CAP_0402_R]
C405  220n/50V  [CAP_0402_R]
C406  220n/50V  [CAP_0402_R]
C407  220n/50V  [CAP_0402_R]
J400  Mini HDMI connector (Type C), angled, SMD  [CON_XKB_A71-05H4-1X1N1]
R400  2k  [RES_0603_R]
R401  0R  [RES_0603_R]
TB400  (no value)  (no BOM)
TP409  ICT  [PCB_TP_ICT_100]  (value not drawn)  (no BOM)
U400  RCLAMP0524PA  [ICC_SLP2510P8_250X100X60_P50_R]
U401  RCLAMP0524PA  [ICC_SLP2510P8_250X100X60_P50_R]

### Ports
HDMI0 (harness HDMI)

### Harnesses
HDMI: HDMI_D0_P, HDMI_D0_N, HDMI_D1_P, HDMI_D1_N, HDMI_CEC, HDMI_DDC_SDA, HDMI_D2_P, HDMI_D2_N, HDMI_CLK_P, HDMI_CLK_N, HDMI_DDC_SCL, HDMI_HPD

### Nets
+3V3: R400.2
+5V: R401.2
+5V_HDMI: J400.18(+5V) R401.1 TP409.1
GND: J400.1(TMDS_D2_SHIELD) J400.4(TMDS_D1_SHIELD) J400.7(TMDS_D0_SHIELD) J400.10(TMDS_CK_SHIELD) J400.13(GND_(DDC/CEC),_SH_HEAC) J400.SH R400.1 U400.3(GND) U400.8(GND) U401.3(GND) U401.8(GND)
CM_HDMI0_CEC: J400.14(CEC) ; port HDMI0.HDMI_CEC
HDMI0_CLK'_N: C403.2 J400.12(TMDS_CK-) U400.5(IO4A) U400.6(IO4B*)
HDMI0_CLK'_P: C402.2 J400.11(TMDS_CK+) U400.4(IO3A) U400.7(IO3B*)
HDMI0_CLK_N: C403.1 ; port HDMI0.HDMI_CLK_N  [project net CM_HDMI0_CLK_N]
HDMI0_CLK_P: C402.1 ; port HDMI0.HDMI_CLK_P  [project net CM_HDMI0_CLK_P]
HDMI0_D0'_N: C407.2 J400.9(TMDS_D0-) U401.5(IO4A) U401.6(IO4B*)
HDMI0_D0'_P: C406.2 J400.8(TMDS_D0+) U401.4(IO3A) U401.7(IO3B*)
HDMI0_D0_N: C407.1 ; port HDMI0.HDMI_D0_N  [project net CM_HDMI0_D0_N]
HDMI0_D0_P: C406.1 ; port HDMI0.HDMI_D0_P  [project net CM_HDMI0_D0_P]
HDMI0_D1'_N: C401.2 J400.6(TMDS_D1-) U400.2(IO2A) U400.9(IO2B*)
HDMI0_D1'_P: C400.2 J400.5(TMDS_D1+) U400.1(IO1A) U400.10(IO1B*)
HDMI0_D1_N: C401.1 ; port HDMI0.HDMI_D1_N  [project net CM_HDMI0_D1_N]
HDMI0_D1_P: C400.1 ; port HDMI0.HDMI_D1_P  [project net CM_HDMI0_D1_P]
HDMI0_D2'_N: C405.2 J400.3(TMDS_D2-) U401.2(IO2A) U401.9(IO2B*)
HDMI0_D2'_P: C404.2 J400.2(TMDS_D2+) U401.1(IO1A) U401.10(IO1B*)
HDMI0_D2_N: C405.1 ; port HDMI0.HDMI_D2_N  [project net CM_HDMI0_D2_N]
HDMI0_D2_P: C404.1 ; port HDMI0.HDMI_D2_P  [project net CM_HDMI0_D2_P]
HDMI0_HPD: J400.19(HPD/HEAC-) ; port HDMI0.HDMI_HPD  [project net CM_HDMI0_HPD]
HDMI0_SCL: J400.15(DDC_SCL) ; port HDMI0.HDMI_DDC_SCL  [project net CM_HDMI0_SCL]
HDMI0_SDA: J400.16(DDC_SDA) ; port HDMI0.HDMI_DDC_SDA  [project net CM_HDMI0_SDA]

Not connected (* = marked no-connect by the designer): J400 17(UTILITY/HEAC+)*

### Layout directives
differential pair: CM_HDMI0_CLK_N, CM_HDMI0_CLK_P, CM_HDMI0_D0_N, CM_HDMI0_D0_P, CM_HDMI0_D1_N, CM_HDMI0_D1_P, CM_HDMI0_D2_N, CM_HDMI0_D2_P, HDMI0_CLK'_N, HDMI0_CLK'_P, HDMI0_D0'_N, HDMI0_D0'_P, HDMI0_D1'_N, HDMI0_D1'_P, HDMI0_D2'_N, HDMI0_D2'_P

### Notes on the sheet
- (near J400) HDMI #0 (TYPE C)
- BOM:
- HDMI #0 connector:
  XKB Connectivity, MPN = A71-05H4-111N1
  Wurth Elektronik, MPN = 685119136923
  Description: Type C (Mini), 19 pins, 0.4mm pitch, angled, SMD.
- 3V3 LOAD
- SCH:
- (near R400) Extra load on the 3V3 power rail to fix the HDMI issue with 5V LED.
- Labels drawn without touching a wire or pin: HDMI0_CEC
- (in symbol ICC-0005) (*NC)
- (in symbol SCH_TITLE_BLOCK_SIMPLE_NODATE) Title; Project:; Version; Variant:

### Library data of the parts
C400-C407 = ITEM_C10044: CAP SMD 220n/50V ±10% 50V X5R (0402); Manufacturer: Murata Electronics; MPN: GRM155R61H224KE01D; Component Subtype: MLCC; Package (Case): 0402; Value: 220nF; Component Type: Capacitor; Mounting Type: SMD
J400 = CON_HDMI_1.4+_MINI_TYPE_C_A1: Connector; HDMI v1.4+; Type C (Mini-HDMI);; Manufacturer: XKB Connectivity; MPN: A71-05H4-111N1; Component Subtype: Mini HDMI (Type C); Component Type: Connector; Mounting Type: SMD; Package (Case): SMD; Value: Mini HDMI connector (Type C), angled, SMD
R400 = RES-0033: as R920 on sheet PWR; Component Type: Resistor; Component Subtype: Thick Film; Value: 2k; Mounting Type: SMD
R401 = RES-0054: as R600 on sheet SD; Component Type: Resistor; Component Subtype: Thick Film; Value: 0R; Mounting Type: SMD
TB400 = SCH_TITLE_BLOCK_SIMPLE_NODATE
TP409 = PCB_TP_ICT: Test Point (ICT); Component Type: Testpoint (for ICT); Mounting Type: Non component; Value: ICT
U400 U401 = ICC-0005: as U200 on sheet USB_C; Component Type: IC; Component Subtype: TVS Arrays; Value: RCLAMP0524PA; Mounting Type: SMD